# EAGLE design PT_2016_PB_MAIN_Rev1 (EAGLE 7.3.0)
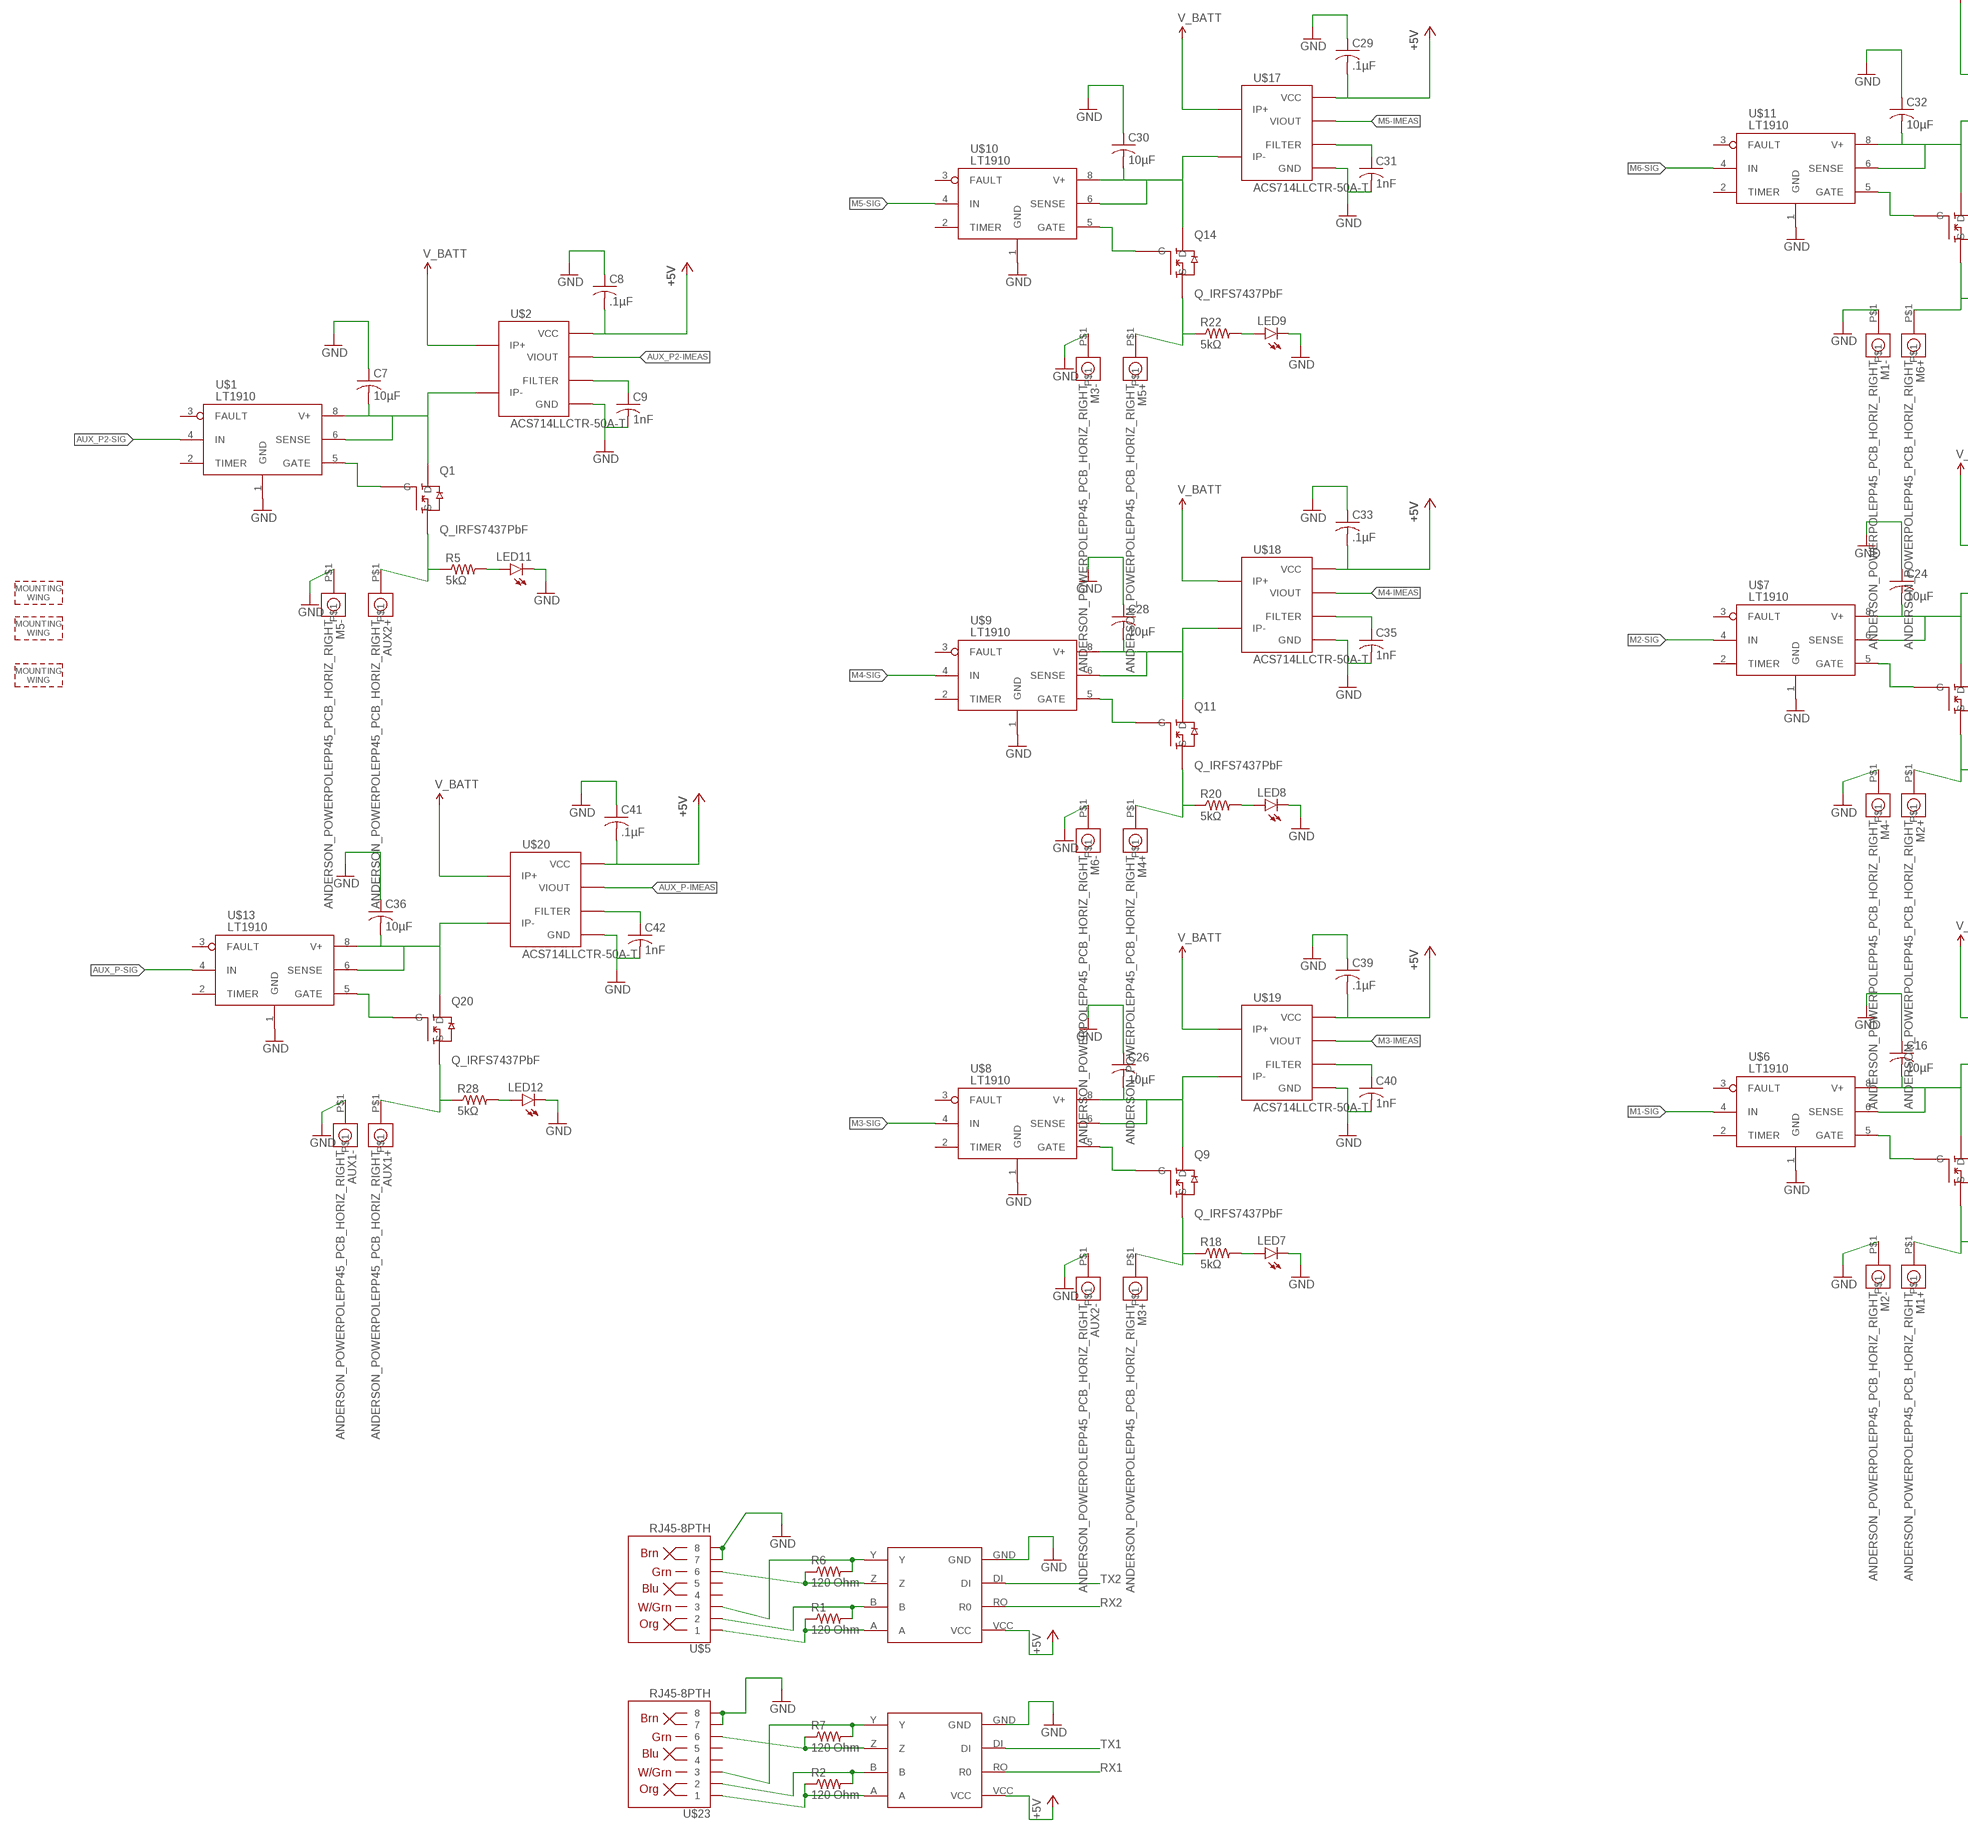
[diagram p0: schematic, sheet 1, part 1 of 3]
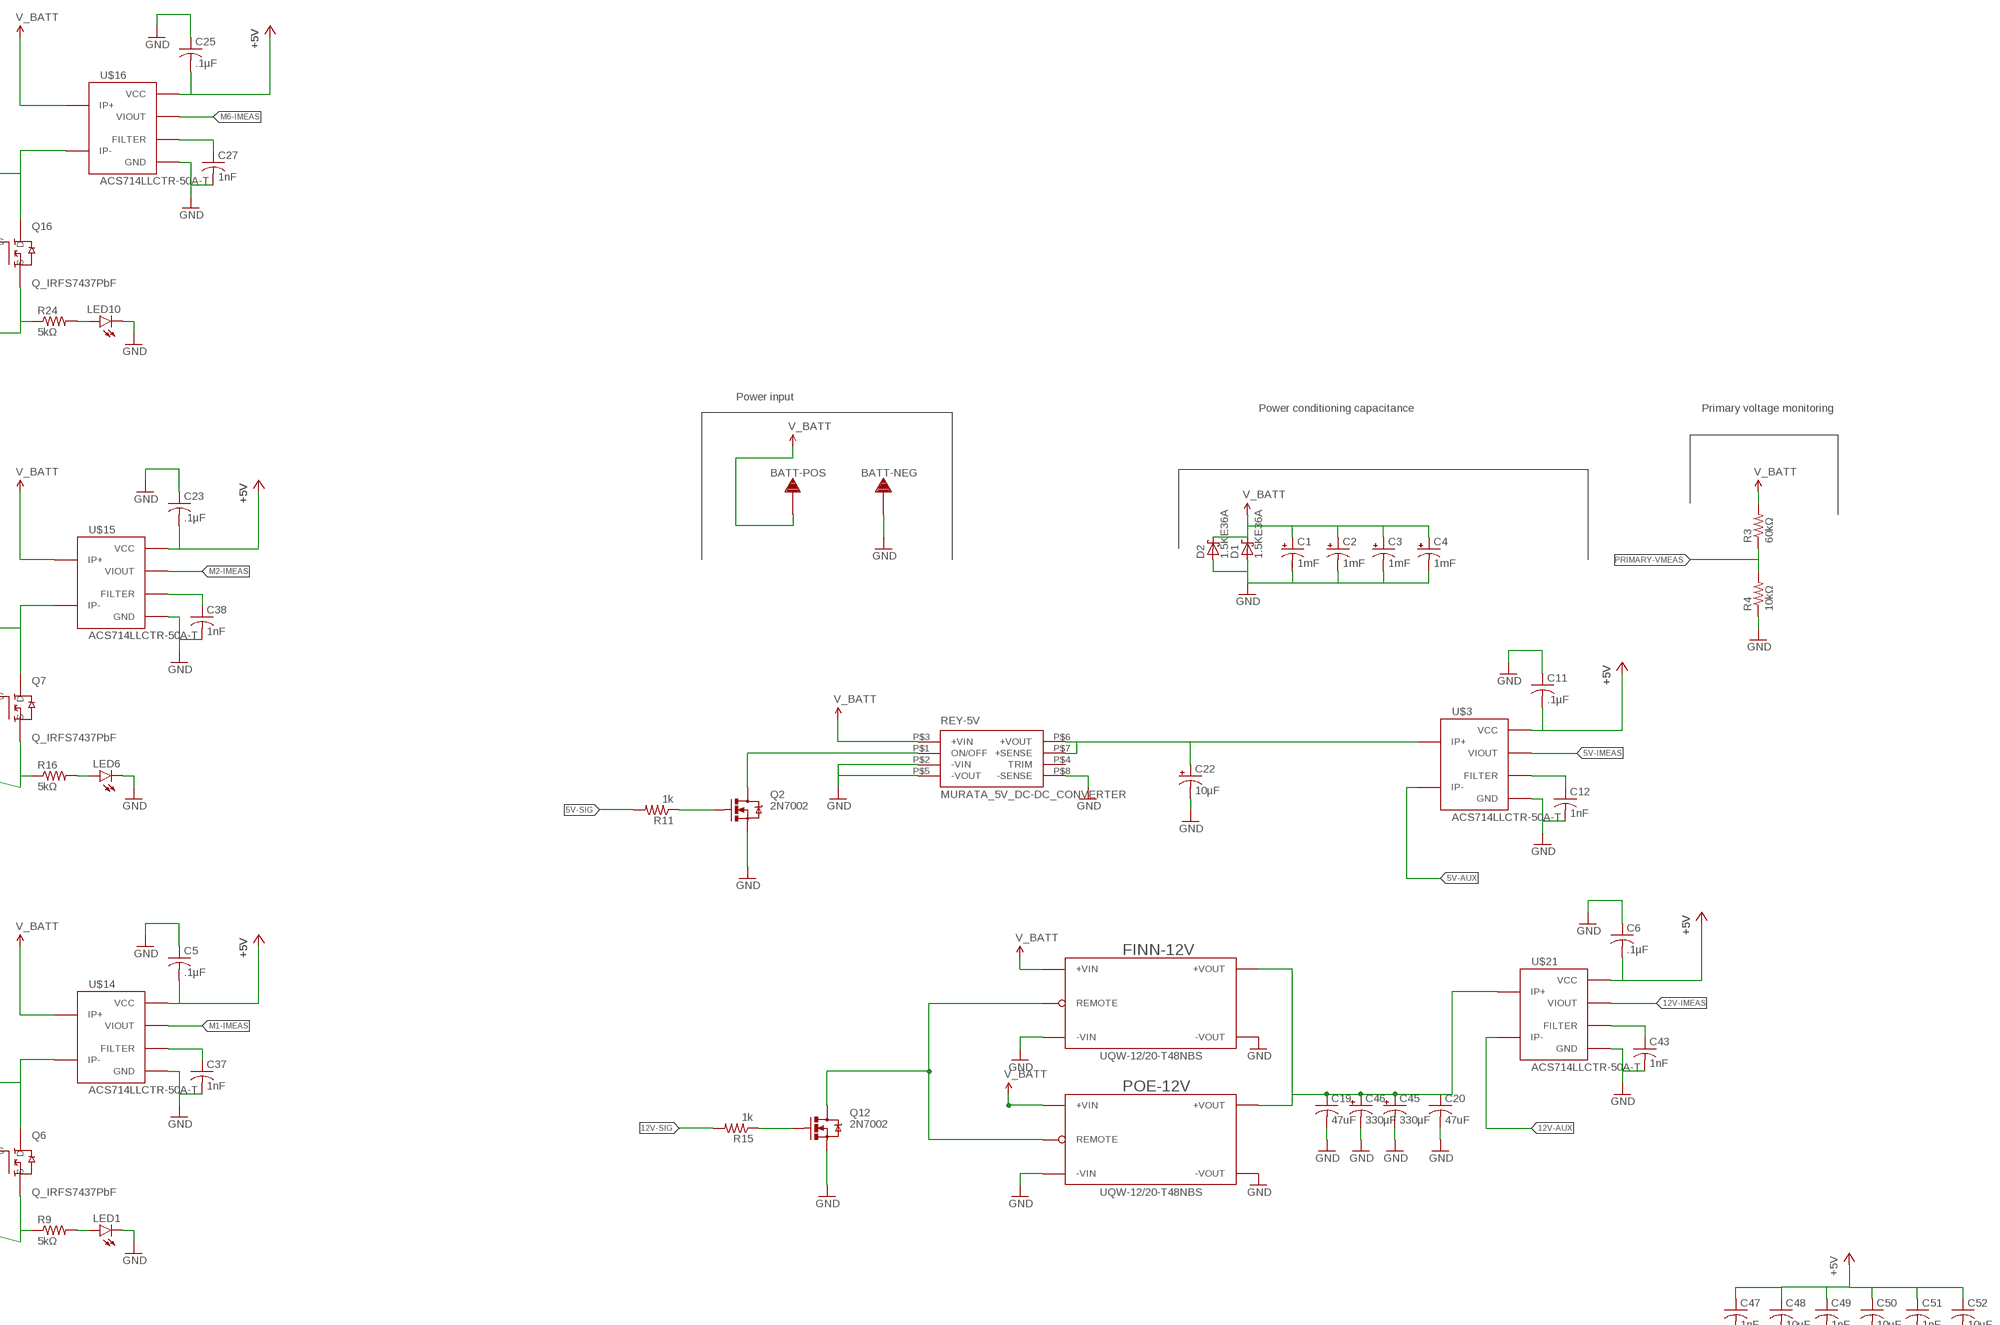
[diagram p1: schematic, sheet 1, part 2 of 3]
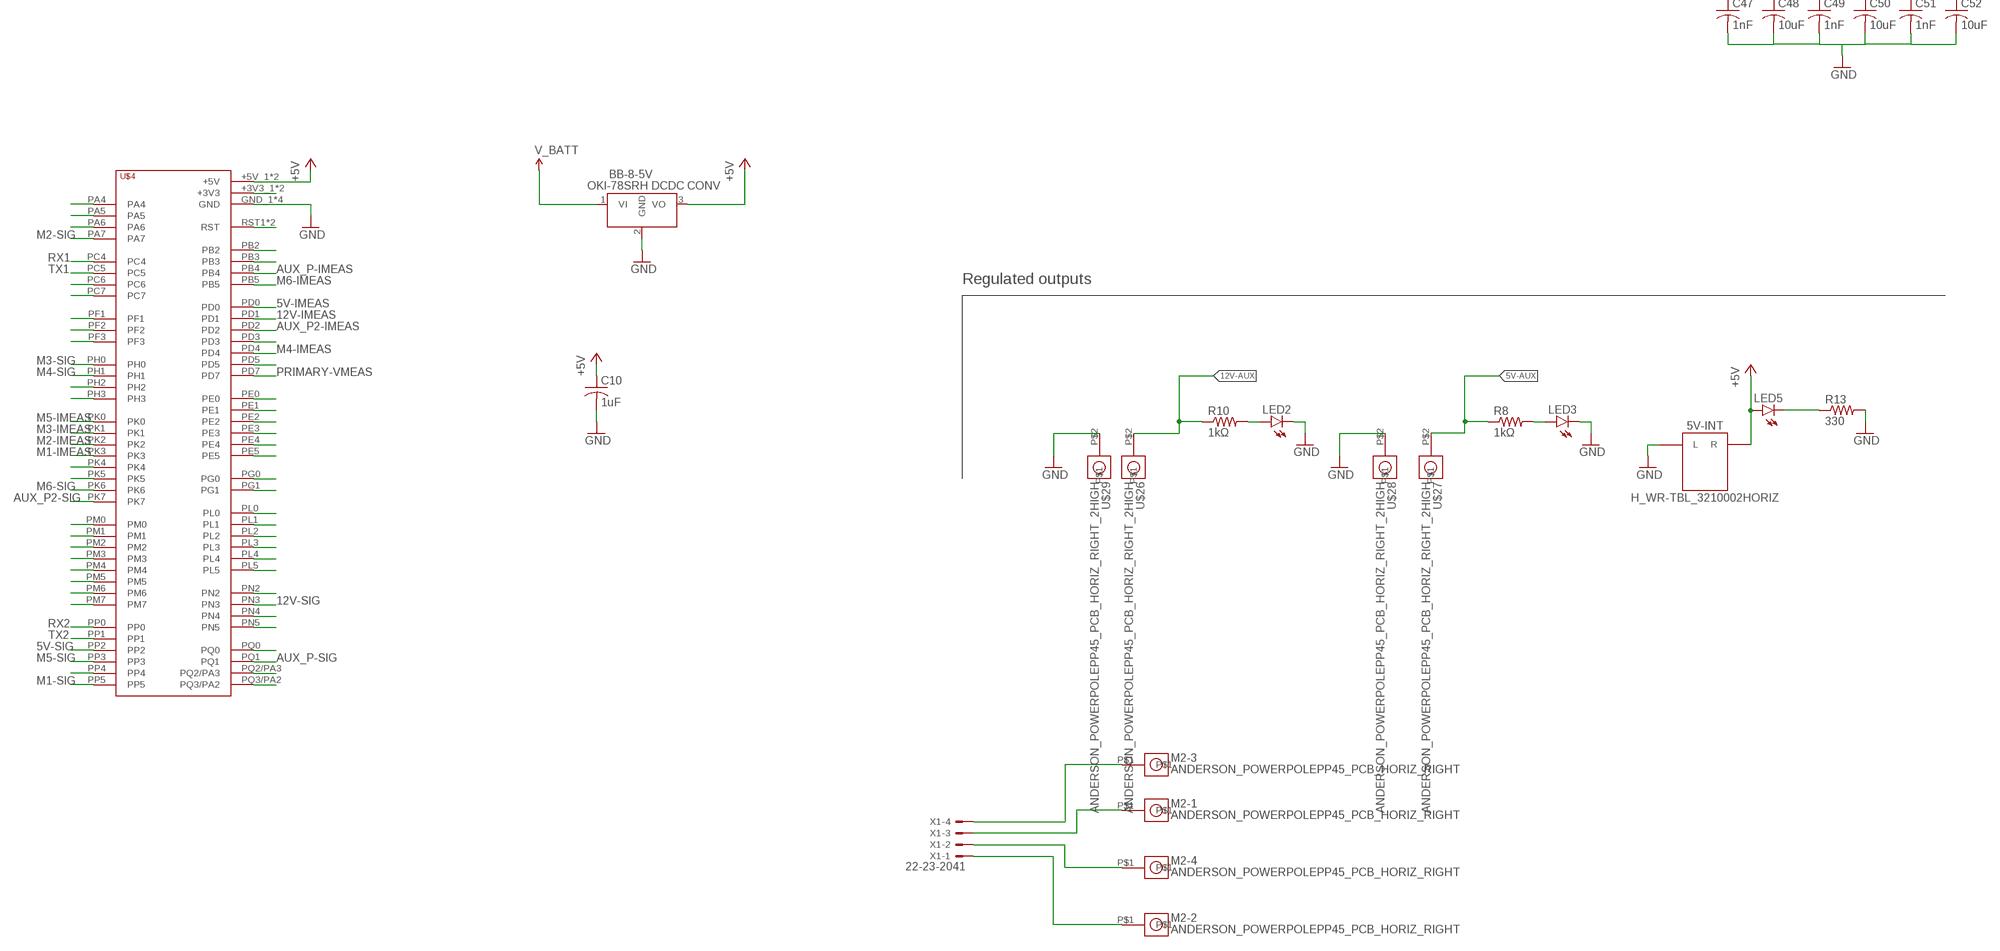
[diagram p2: schematic, sheet 1, part 3 of 3]

## Parts
5V-INT  H_WR-TBL_3210002HORIZ  [691322110002]
AUX1+  ANDERSON_POWERPOLEPP45_PCB_HORIZ_RIGHT  [APP45_PCB_HORIZ_RIGHT]
AUX1-  ANDERSON_POWERPOLEPP45_PCB_HORIZ_RIGHT  [APP45_PCB_HORIZ_RIGHT]
AUX2+  ANDERSON_POWERPOLEPP45_PCB_HORIZ_RIGHT  [APP45_PCB_HORIZ_RIGHT]
AUX2-  ANDERSON_POWERPOLEPP45_PCB_HORIZ_RIGHT  [APP45_PCB_HORIZ_RIGHT]
BATT-NEG  TERMINAL_HOLE  [LARGE_TERMINAL_HOLE]
BATT-POS  TERMINAL_HOLE  [LARGE_TERMINAL_HOLE]
BB-8-5V  Q_OKI-78SR  [OKI-78SRH]
C1  1mF  C_POL12.5MM_NORMAL  [C_12.5MM]
C2  1mF  C_POL12.5MM_NORMAL  [C_12.5MM]
C3  1mF  C_POL12.5MM_NORMAL  [C_12.5MM]
C4  1mF  C_POL12.5MM_NORMAL  [C_12.5MM]
C5  .1µF  C-USC1206  [C1206]
C6  .1µF  C-USC1206  [C1206]
C7  10µF  C-USC1206  [C1206]
C8  .1µF  C-USC1206  [C1206]
C9  1nF  C-USC1206  [C1206]
C10  1uF  C-USC1206  [C1206]
C11  .1µF  C-USC1206  [C1206]
C12  1nF  C-USC1206  [C1206]
C16  10µF  C-USC1206  [C1206]
C19  47uF  C-USC1206  [C1206]
C20  47uF  C-USC1206  [C1206]
C22  10µF  CPOL-USE5-8.5  [E5-8,5]
C23  .1µF  C-USC1206  [C1206]
C24  10µF  C-USC1206  [C1206]
C25  .1µF  C-USC1206  [C1206]
C26  10µF  C-USC1206  [C1206]
C27  1nF  C-USC1206  [C1206]
C28  10µF  C-USC1206  [C1206]
C29  .1µF  C-USC1206  [C1206]
C30  10µF  C-USC1206  [C1206]
C31  1nF  C-USC1206  [C1206]
C32  10µF  C-USC1206  [C1206]
C33  .1µF  C-USC1206  [C1206]
C35  1nF  C-USC1206  [C1206]
C36  10µF  C-USC1206  [C1206]
C37  1nF  C-USC1206  [C1206]
C38  1nF  C-USC1206  [C1206]
C39  .1µF  C-USC1206  [C1206]
C40  1nF  C-USC1206  [C1206]
C41  .1µF  C-USC1206  [C1206]
C42  1nF  C-USC1206  [C1206]
C43  1nF  C-USC1206  [C1206]
C45  330µF  CPOL-USE5-8.5  [E5-8,5]
C46  330µF  CPOL-USE5-8.5  [E5-8,5]
C47  1nF  C-USC1206  [C1206]
C48  10uF  C-USC1206  [C1206]
C49  1nF  C-USC1206  [C1206]
C50  10uF  C-USC1206  [C1206]
C51  1nF  C-USC1206  [C1206]
C52  10uF  C-USC1206  [C1206]
D1  1.5KE36A  15KEXX  [CB429-17]
D2  1.5KE36A  15KEXX  [CB429-17]
FINN-12V  UQW-12/20-T48NBS  [U-T48-QB-NO_TRIM]
LED1  LED1206  [LED-1206]
LED2  LED1206  [LED-1206]
LED3  LED1206  [LED-1206]
LED5  LED1206  [LED-1206]
LED6  LED1206  [LED-1206]
LED7  LED1206  [LED-1206]
LED8  LED1206  [LED-1206]
LED9  LED1206  [LED-1206]
LED10  LED1206  [LED-1206]
LED11  LED1206  [LED-1206]
LED12  LED1206  [LED-1206]
M1+  ANDERSON_POWERPOLEPP45_PCB_HORIZ_RIGHT  [APP45_PCB_HORIZ_RIGHT]
M1-  ANDERSON_POWERPOLEPP45_PCB_HORIZ_RIGHT  [APP45_PCB_HORIZ_RIGHT]
M2+  ANDERSON_POWERPOLEPP45_PCB_HORIZ_RIGHT  [APP45_PCB_HORIZ_RIGHT]
M2-  ANDERSON_POWERPOLEPP45_PCB_HORIZ_RIGHT  [APP45_PCB_HORIZ_RIGHT]
M2-1  ANDERSON_POWERPOLEPP45_PCB_HORIZ_RIGHT  [APP45_PCB_HORIZ_RIGHT]
M2-2  ANDERSON_POWERPOLEPP45_PCB_HORIZ_RIGHT  [APP45_PCB_HORIZ_RIGHT]
M2-3  ANDERSON_POWERPOLEPP45_PCB_HORIZ_RIGHT  [APP45_PCB_HORIZ_RIGHT]
M2-4  ANDERSON_POWERPOLEPP45_PCB_HORIZ_RIGHT  [APP45_PCB_HORIZ_RIGHT]
M3+  ANDERSON_POWERPOLEPP45_PCB_HORIZ_RIGHT  [APP45_PCB_HORIZ_RIGHT]
M3-  ANDERSON_POWERPOLEPP45_PCB_HORIZ_RIGHT  [APP45_PCB_HORIZ_RIGHT]
M4+  ANDERSON_POWERPOLEPP45_PCB_HORIZ_RIGHT  [APP45_PCB_HORIZ_RIGHT]
M4-  ANDERSON_POWERPOLEPP45_PCB_HORIZ_RIGHT  [APP45_PCB_HORIZ_RIGHT]
M5+  ANDERSON_POWERPOLEPP45_PCB_HORIZ_RIGHT  [APP45_PCB_HORIZ_RIGHT]
M5-  ANDERSON_POWERPOLEPP45_PCB_HORIZ_RIGHT  [APP45_PCB_HORIZ_RIGHT]
M6+  ANDERSON_POWERPOLEPP45_PCB_HORIZ_RIGHT  [APP45_PCB_HORIZ_RIGHT]
M6-  ANDERSON_POWERPOLEPP45_PCB_HORIZ_RIGHT  [APP45_PCB_HORIZ_RIGHT]
POE-12V  UQW-12/20-T48NBS  [U-T48-QB-NO_TRIM]
Q1  Q_IRFS7437PbF  Q_IRF7437SMD  [D2PACK]
Q2  2N7002  MOSFET-NCHANNEL2N7002PW  [SOT323]
Q6  Q_IRFS7437PbF  Q_IRF7437SMD  [D2PACK]
Q7  Q_IRFS7437PbF  Q_IRF7437SMD  [D2PACK]
Q9  Q_IRFS7437PbF  Q_IRF7437SMD  [D2PACK]
Q11  Q_IRFS7437PbF  Q_IRF7437SMD  [D2PACK]
Q12  2N7002  MOSFET-NCHANNEL2N7002PW  [SOT323]
Q14  Q_IRFS7437PbF  Q_IRF7437SMD  [D2PACK]
Q16  Q_IRFS7437PbF  Q_IRF7437SMD  [D2PACK]
Q20  Q_IRFS7437PbF  Q_IRF7437SMD  [D2PACK]
R1  120 Ohm  RESISTOR1206  [1206]
R2  120 Ohm  RESISTOR1206  [1206]
R3  60kΩ  R-US_R1206  [R1206]
R4  10kΩ  R-US_R1206  [R1206]
R5  5kΩ  RESISTOR1206  [1206]
R6  120 Ohm  RESISTOR1206  [1206]
R7  120 Ohm  RESISTOR1206  [1206]
R8  1kΩ  RESISTOR1206  [1206]
R9  5kΩ  RESISTOR1206  [1206]
R10  1kΩ  RESISTOR1206  [1206]
R11  1k  R-US_R1206  [R1206]
R13  330  RESISTOR1206  [1206]
R15  1k  R-US_R1206  [R1206]
R16  5kΩ  RESISTOR1206  [1206]
R18  5kΩ  RESISTOR1206  [1206]
R20  5kΩ  RESISTOR1206  [1206]
R22  5kΩ  RESISTOR1206  [1206]
R24  5kΩ  RESISTOR1206  [1206]
R28  5kΩ  RESISTOR1206  [1206]
REY-5V  MURATA_5V_DC-DC_CONVERTER  [MURATA_5V_DC-DC_CONVERTER]
U$1  LT1910  [SO8]
U$2  ACS714LLCTR-50A-T  Q_ACS714_SKETCH  [SOIC8_ACS711_SKETCH]
U$3  ACS714LLCTR-50A-T  Q_ACS714  [SOIC8_ACS711]
U$4  TIVA-C-CONNECTED  [TIVA-C-CONNECTED]
U$5  RJ45-8PTH  [RJ45-8]
U$6  LT1910  [SO8]
U$7  LT1910  [SO8]
U$8  LT1910  [SO8]
U$9  LT1910  [SO8]
U$10  LT1910  [SO8]
U$11  LT1910  [SO8]
U$12  MAX3077  [MAX3070E]
U$13  LT1910  [SO8]
U$14  ACS714LLCTR-50A-T  Q_ACS714_SKETCH  [SOIC8_ACS711_SKETCH]
U$15  ACS714LLCTR-50A-T  Q_ACS714_SKETCH  [SOIC8_ACS711_SKETCH]
U$16  ACS714LLCTR-50A-T  Q_ACS714_SKETCH  [SOIC8_ACS711_SKETCH]
U$17  ACS714LLCTR-50A-T  Q_ACS714_SKETCH  [SOIC8_ACS711_SKETCH]
U$18  ACS714LLCTR-50A-T  Q_ACS714_SKETCH  [SOIC8_ACS711_SKETCH]
U$19  ACS714LLCTR-50A-T  Q_ACS714_SKETCH  [SOIC8_ACS711_SKETCH]
U$20  ACS714LLCTR-50A-T  Q_ACS714_SKETCH  [SOIC8_ACS711_SKETCH]
U$21  ACS714LLCTR-50A-T  Q_ACS714  [SOIC8_ACS711]
U$23  RJ45-8PTH  [RJ45-8]
U$24  MAX3077  [MAX3070E]
U$25  APP_MOUTING_WINGHORIZ  [APP45_MOUNTING_WING_HORIZ]
U$26  ANDERSON_POWERPOLEPP45_PCB_HORIZ_RIGHT_2HIGH  [APP45_PCB_HORIZ_RIGHT_2HIGH]
U$27  ANDERSON_POWERPOLEPP45_PCB_HORIZ_RIGHT_2HIGH  [APP45_PCB_HORIZ_RIGHT_2HIGH]
U$28  ANDERSON_POWERPOLEPP45_PCB_HORIZ_RIGHT_2HIGH  [APP45_PCB_HORIZ_RIGHT_2HIGH]
U$29  ANDERSON_POWERPOLEPP45_PCB_HORIZ_RIGHT_2HIGH  [APP45_PCB_HORIZ_RIGHT_2HIGH]
U$41  APP_MOUTING_WINGHORIZ  [APP45_MOUNTING_WING_HORIZ]
U$42  APP_MOUTING_WINGHORIZ  [APP45_MOUNTING_WING_HORIZ]
X1  22-23-2041  [22-23-2041]

## Nets
5V-AUX: R8.1 U$3.4(IP-) U$27.P$2
5V-IMEAS: U$3.7(VIOUT) U$4.PD0
5V-SIG: R11.2 U$4.PP2
12V-AUX: R10.1 U$21.4(IP-) U$26.P$2
12V-IMEAS: U$4.PD1 U$21.7(VIOUT)
12V-SIG: R15.2 U$4.PN3
+5V: 5V-INT.R BB-8-5V.3(VO) C5.2 C6.2 C8.2 C10.1 C11.2 C23.2 C25.2 C29.2 C33.2 C39.2 C41.2 C47.1 C48.1 C49.1 C50.1 C51.1 C52.1 LED5.A U$2.8(VCC) U$3.8(VCC) U$4.+5V_1(+5V) U$4.+5V_2(+5V) U$12.VCC U$14.8(VCC) U$15.8(VCC) U$16.8(VCC) U$17.8(VCC) U$18.8(VCC) U$19.8(VCC) U$20.8(VCC) U$21.8(VCC) U$24.VCC
AUX_P2-IMEAS: U$2.7(VIOUT) U$4.PD2
AUX_P2-SIG: U$1.4(IN) U$4.PK7
AUX_P-IMEAS: U$4.PB4 U$20.7(VIOUT)
AUX_P-SIG: U$4.PQ1 U$13.4(IN)
GND: 5V-INT.L AUX1-.P$1 AUX2-.P$1 BATT-NEG.P$1 BB-8-5V.2(GND) C1.- C2.- C3.- C4.- C5.1 C6.1 C7.1 C8.1 C9.2 C10.2 C11.1 C12.2 C16.1 C19.2 C20.2 C22.- C23.1 C24.1 C25.1 C26.1 C27.2 C28.1 C29.1 C30.1 C31.2 C32.1 C33.1 C35.2 C36.1 C37.2 C38.2 C39.1 C40.2 C41.1 C42.2 C43.2 C45.- C46.- C47.2 C48.2 C49.2 C50.2 C51.2 C52.2 D1.A D2.A FINN-12V.3(-VIN) FINN-12V.4(-VOUT) LED1.C LED2.C LED3.C LED6.C LED7.C LED8.C LED9.C LED10.C LED11.C LED12.C M1-.P$1 M2-.P$1 M3-.P$1 M4-.P$1 M5-.P$1 M6-.P$1 POE-12V.3(-VIN) POE-12V.4(-VOUT) Q2.2(S) Q12.2(S) R4.1 R13.2 REY-5V.P$2(-VIN) REY-5V.P$5(-VOUT) REY-5V.P$8(-SENSE) U$1.1(GND) U$2.5(GND) U$3.5(GND) U$4.GND_1(GND) U$4.GND_2(GND) U$4.GND_3(GND) U$4.GND_4(GND) U$5.7 U$5.8 U$6.1(GND) U$7.1(GND) U$8.1(GND) U$9.1(GND) U$10.1(GND) U$11.1(GND) U$12.GND U$13.1(GND) U$14.5(GND) U$15.5(GND) U$16.5(GND) U$17.5(GND) U$18.5(GND) U$19.5(GND) U$20.5(GND) U$21.5(GND) U$23.7 U$23.8 U$24.GND U$28.P$2 U$29.P$2
M1-IMEAS: U$4.PK3 U$14.7(VIOUT)
M1-SIG: U$4.PP5 U$6.4(IN)
M2-IMEAS: U$4.PK2 U$15.7(VIOUT)
M2-SIG: U$4.PA7 U$7.4(IN)
M3-IMEAS: U$4.PK1 U$19.7(VIOUT)
M3-SIG: U$4.PH0 U$8.4(IN)
M4-IMEAS: U$4.PD4 U$18.7(VIOUT)
M4-SIG: U$4.PH1 U$9.4(IN)
M5-IMEAS: U$4.PK0 U$17.7(VIOUT)
M5-SIG: U$4.PP3 U$10.4(IN)
M6-IMEAS: U$4.PB5 U$16.7(VIOUT)
M6-SIG: U$4.PK6 U$11.4(IN)
N$1: C37.1 U$14.6(FILTER)
N$2: C38.1 U$15.6(FILTER)
N$3: M2-3.P$1 X1.4
N$4: FINN-12V.2(REMOTE) POE-12V.2(REMOTE) Q12.3(D)
N$5: M2-1.P$1 X1.3
N$6: LED5.C R13.1
N$7: C22.+ REY-5V.P$6(+VOUT) REY-5V.P$7(+SENSE) U$3.1(IP+)
N$8: M2-4.P$1 X1.2
N$9: C7.2 Q1.TAB(D) U$1.6(SENSE) U$1.8(V+) U$2.4(IP-)
N$10: AUX2+.P$1 Q1.2(S) R5.1
N$11: M2-2.P$1 X1.1
N$12: C43.1 U$21.6(FILTER)
N$14: Q1.1(G) U$1.5(GATE)
N$15: LED11.A R5.2
N$16: C9.1 U$2.6(FILTER)
N$17: C27.1 U$16.6(FILTER)
N$21: U$4.PH3
N$22: C31.1 U$17.6(FILTER)
N$23: C35.1 U$18.6(FILTER)
N$24: C40.1 U$19.6(FILTER)
N$25: C42.1 U$20.6(FILTER)
N$28: C24.2 Q7.TAB(D) U$7.6(SENSE) U$7.8(V+) U$15.4(IP-)
N$29: M2+.P$1 Q7.2(S) R16.1
N$30: Q7.1(G) U$7.5(GATE)
N$31: LED6.A R16.2
N$33: C19.1 C20.1 C45.+ C46.+ FINN-12V.8(+VOUT) POE-12V.8(+VOUT) U$21.1(IP+)
N$34: LED3.A R8.2
N$35: U$4.PA4
N$36: U$4.PA5
N$37: U$4.PA6
N$38: C12.1 U$3.6(FILTER)
N$39: LED1.A R9.2
N$40: C16.2 Q6.TAB(D) U$6.6(SENSE) U$6.8(V+) U$14.4(IP-)
N$41: M1+.P$1 Q6.2(S) R9.1
N$42: Q6.1(G) U$6.5(GATE)
N$43: Q2.3(D) REY-5V.P$1(ON/OFF)
N$44: C26.2 Q9.TAB(D) U$8.6(SENSE) U$8.8(V+) U$19.4(IP-)
N$45: M3+.P$1 Q9.2(S) R18.1
N$46: LED2.A R10.2
N$47: Q9.1(G) U$8.5(GATE)
N$48: Q2.1(G) R11.1
N$49: LED7.A R18.2
N$50: U$4.PC6
N$51: U$4.PC7
N$52: U$4.PF1
N$53: U$4.PF2
N$54: C28.2 Q11.TAB(D) U$9.6(SENSE) U$9.8(V+) U$18.4(IP-)
N$55: M4+.P$1 Q11.2(S) R20.1
N$56: Q11.1(G) U$9.5(GATE)
N$57: LED8.A R20.2
N$58: U$4.PF3
N$60: C30.2 Q14.TAB(D) U$10.6(SENSE) U$10.8(V+) U$17.4(IP-)
N$61: M5+.P$1 Q14.2(S) R22.1
N$62: Q14.1(G) U$10.5(GATE)
N$63: LED9.A R22.2
N$66: C32.2 Q16.TAB(D) U$11.6(SENSE) U$11.8(V+) U$16.4(IP-)
N$67: M6+.P$1 Q16.2(S) R24.1
N$68: Q16.1(G) U$11.5(GATE)
N$69: LED10.A R24.2
N$70: U$4.PH2
N$75: U$4.PK4
N$78: C36.2 Q20.TAB(D) U$13.6(SENSE) U$13.8(V+) U$20.4(IP-)
N$79: AUX1+.P$1 Q20.2(S) R28.1
N$80: Q20.1(G) U$13.5(GATE)
N$81: LED12.A R28.2
N$82: U$4.PK5
N$83: U$4.PM0
N$84: U$4.PM1
N$85: U$4.PM2
N$86: U$4.PM3
N$87: U$4.PM4
N$88: U$4.PM5
N$89: U$4.PM6
N$90: U$4.PM7
N$93: U$4.PP4
N$96: U$4.PN2
N$98: U$4.+3V3_1(+3V3) U$4.+3V3_2(+3V3)
N$99: U$4.PL5
N$100: U$4.RST1(RST) U$4.RST_2(RST)
N$101: U$4.PB2
N$102: U$4.PB3
N$108: U$4.PD3
N$110: U$4.PD5
N$112: U$4.PE0
N$113: U$4.PE1
N$114: Q12.1(G) R15.1
N$115: U$4.PE2
N$116: U$4.PE3
N$117: U$4.PE4
N$118: U$4.PE5
N$119: U$4.PG0
N$120: U$4.PG1
N$121: U$4.PL0
N$122: U$4.PL1
N$123: U$4.PL2
N$124: U$4.PL3
N$125: U$4.PL4
N$129: U$4.PN4
N$130: U$4.PN5
N$131: U$4.PQ0
N$133: U$4.PQ2/PA3
N$134: U$4.PQ3/PA2
PRIMARY-VMEAS: R3.1 R4.2 U$4.PD7
REC+: R1.1 U$5.1 U$12.A
REC+1: R2.1 U$23.1 U$24.A
REC-: R1.2 U$5.2 U$12.B
REC-1: R2.2 U$23.2 U$24.B
RX1: U$4.PC4 U$24.RO(R0)
RX2: U$4.PP0 U$12.RO(R0)
TRANS+: R6.2 U$5.3 U$12.Y
TRANS+1: R7.2 U$23.3 U$24.Y
TRANS-: R6.1 U$5.6 U$12.Z
TRANS-1: R7.1 U$23.6 U$24.Z
TX1: U$4.PC5 U$24.DI
TX2: U$4.PP1 U$12.DI
V_BATT: BATT-POS.P$1 BB-8-5V.1(VI) C1.+ C2.+ C3.+ C4.+ D1.C D2.C FINN-12V.1(+VIN) POE-12V.1(+VIN) R3.2 REY-5V.P$3(+VIN) U$2.1(IP+) U$14.1(IP+) U$15.1(IP+) U$16.1(IP+) U$17.1(IP+) U$18.1(IP+) U$19.1(IP+) U$20.1(IP+)
Unconnected: REY-5V.P$4(TRIM) U$1.2(TIMER) U$1.3(FAULT) U$5.4 U$5.5 U$6.2(TIMER) U$6.3(FAULT) U$7.2(TIMER) U$7.3(FAULT) U$8.2(TIMER) U$8.3(FAULT) U$9.2(TIMER) U$9.3(FAULT) U$10.2(TIMER) U$10.3(FAULT) U$11.2(TIMER) U$11.3(FAULT) U$13.2(TIMER) U$13.3(FAULT) U$23.4 U$23.5

## Notes on the sheet
- Power input
- Power conditioning capacitance | Primary voltage monitoring
- Regulated outputs

## Library data of the parts
5V-INT = MRDT-2015-PowerBoard:H_WR-TBL_32*1*0002: Wurth Electronic's 2-pin 10A pluggable screw terminal headers. Vertical and Horizantal Part Numbers: 691322110002 (Horizantal) 691321100002 (Vertical); DIGIKEY_PN: 732-2769-ND
AUX1+ AUX1- AUX2+ AUX2- M1+ M1- M2+ M2- M2-1-M2-4 M3+ M3- M4+ M4- M5+ M5- M6+ M6- U$26-U$29 = MRDT-Connectors:ANDERSON_POWERPOLE: http://www.powerwerx.com/anderson-powerpoles/
BATT-NEG BATT-POS = MRDT-2015-PowerBoard:TERMINAL_HOLE
BB-8-5V = MRDT-2015-PowerBoard:Q_OKI-78SR: 4.95W DC/DC Converter Manufacturer: Murata Part Number: OKI-78SR-5/1.5-W36H-C OKI-78SR-3.3/1.5-W36H-C
C1-C4 = MRDT-2014-All:C_POL: Alum Elect. Cap with 10mm diameter, 5mm lead spacing and 0.7mm lead diameter
C5-C12 C16 C19 C20 C23-C33 C35-C43 C47-C52 = resistor:C-US: CAPACITOR, American symbol
C22 C45 C46 = resistor:CPOL-US: POLARIZED CAPACITOR, American symbol
D1 D2 = diode:15KEXX: DIODE
FINN-12V POE-12V = MRDT-2015-PowerBoard:UQW-12/20-T48NBS
LED1-LED3 LED5-LED12 = SparkFun-LED:LED: LEDs Standard schematic elements and footprints for 5mm, 3mm, 1206, and 0603 sized LEDs. 5mm - Spark Fun Electronics SKU : COM-00529 (and others)
Q1 Q6 Q7 Q9 Q11 Q14 Q16 Q20 = MRDT-2015-PowerBoard:Q_IRF*7437: 40V 195A N-CH MOSFET switch with heatsink
Q2 Q12 = SparkFun-DiscreteSemi:MOSFET-NCHANNEL: Common NMOSFET Parts MFG P/N Store ID Prod ID FDD8780 TRANS-09984 SI7820DN TRANS-11055 FDS6630A IC-08089 2N7002PW TRANS-11151 FQP30N06L COM-10213 TRANS-10060 BSS123LT1G TRANS-08345 BSS138 TRANS-00830 BS170 2N7000; PROD_ID: TRANS-11151
R1 R2 R5-R10 R13 R16 R18 R20 R22 R24 R28 = SparkFun-Passives:RESISTOR: Resistor Basic schematic elements and footprints for 0603, 1206, and PTH resistors.
R3 R4 R11 R15 = resistor:R-US_: RESISTOR, American symbol
REY-5V = MRDT-2015-PowerBoard:MURATA_5V_DC-DC_CONVERTER
U$1 U$6-U$11 U$13 = Jake:LT1910
U$2 U$3 U$14-U$21 = MRDT-2015-PowerBoard:Q_ACS714: Sketch variant has increased clearance for traces.
U$4 = MRDT-2015-General:TIVA-C-CONNECTED: TIVA C CONNECTED LAUNCHPAD
U$5 U$23 = SparkFun-Connectors:RJ45-8: RJ45 Jack Simple RJ45, 8-pin connection - connector for common Cat5, Cat5e, and Cat6 Ethernet cables. Footprint not yet proven in production. Connector sku is PRT-00643; Breakout PCB sku is BOB-00716.; PROD_ID: CONN-08506; VALUE: RJ45
U$12 U$24 = MAX3077:MAX3077
U$25 U$41 U$42 = MRDT-Connectors:APP_MOUTING_WING
X1 = con-molex:22-23-2041: .100" (2.54mm) Center Header - 4 Pin; MF: MOLEX; MPN: 22-23-2041; OC_FARNELL: 1462920; OC_NEWARK: 38C0355

## Board
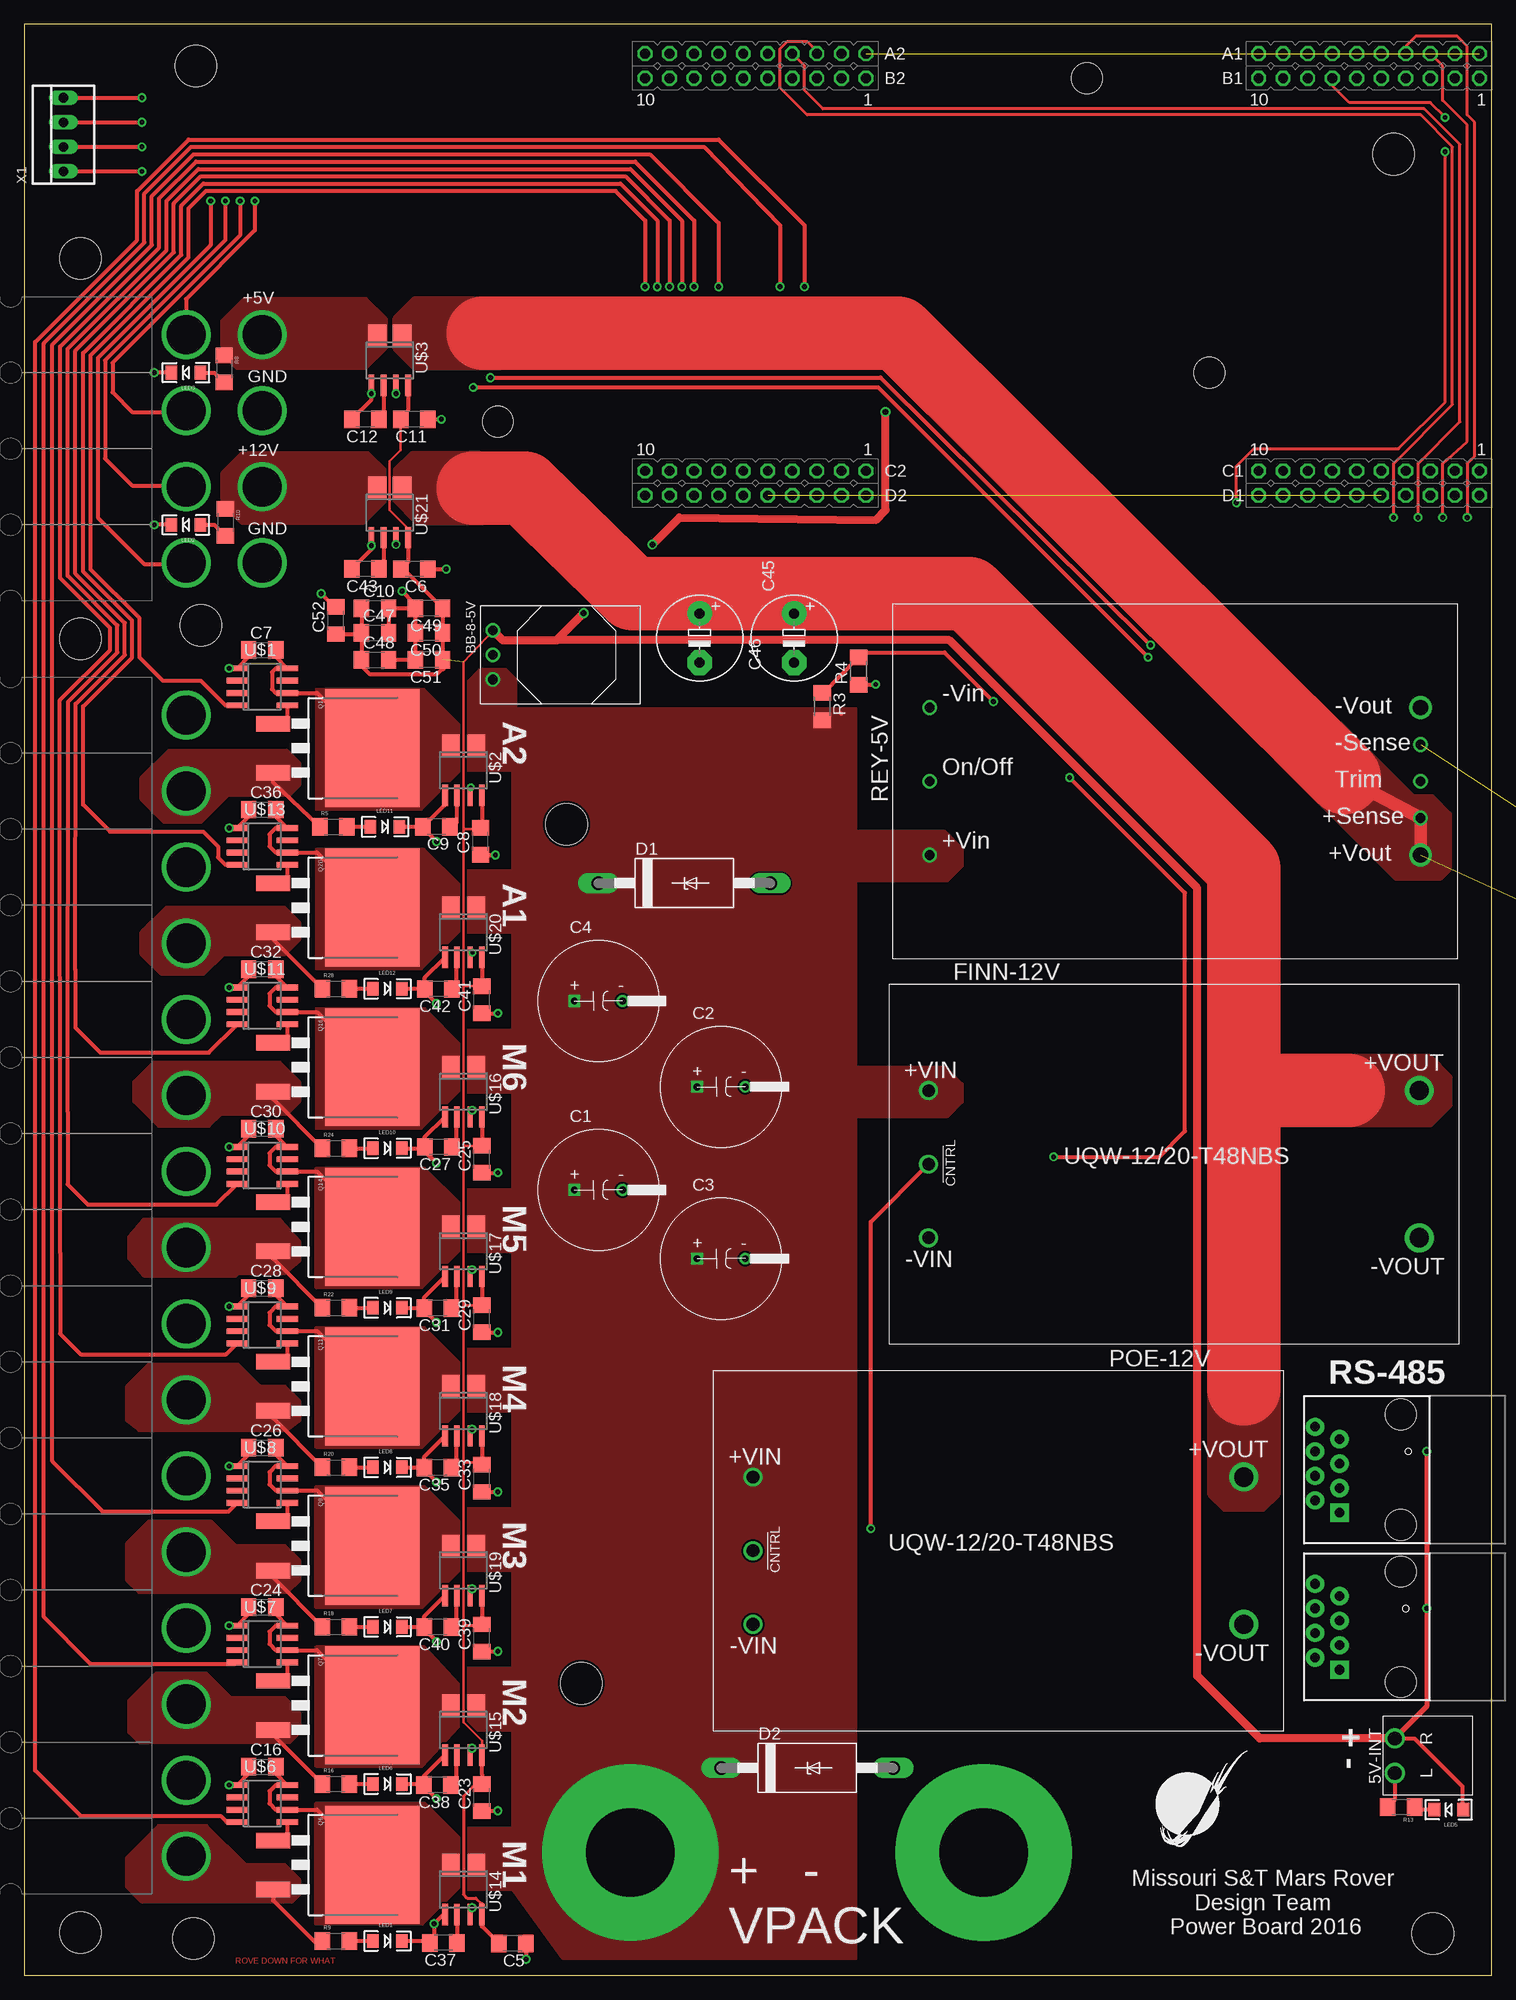
[diagram p3: board, top side]
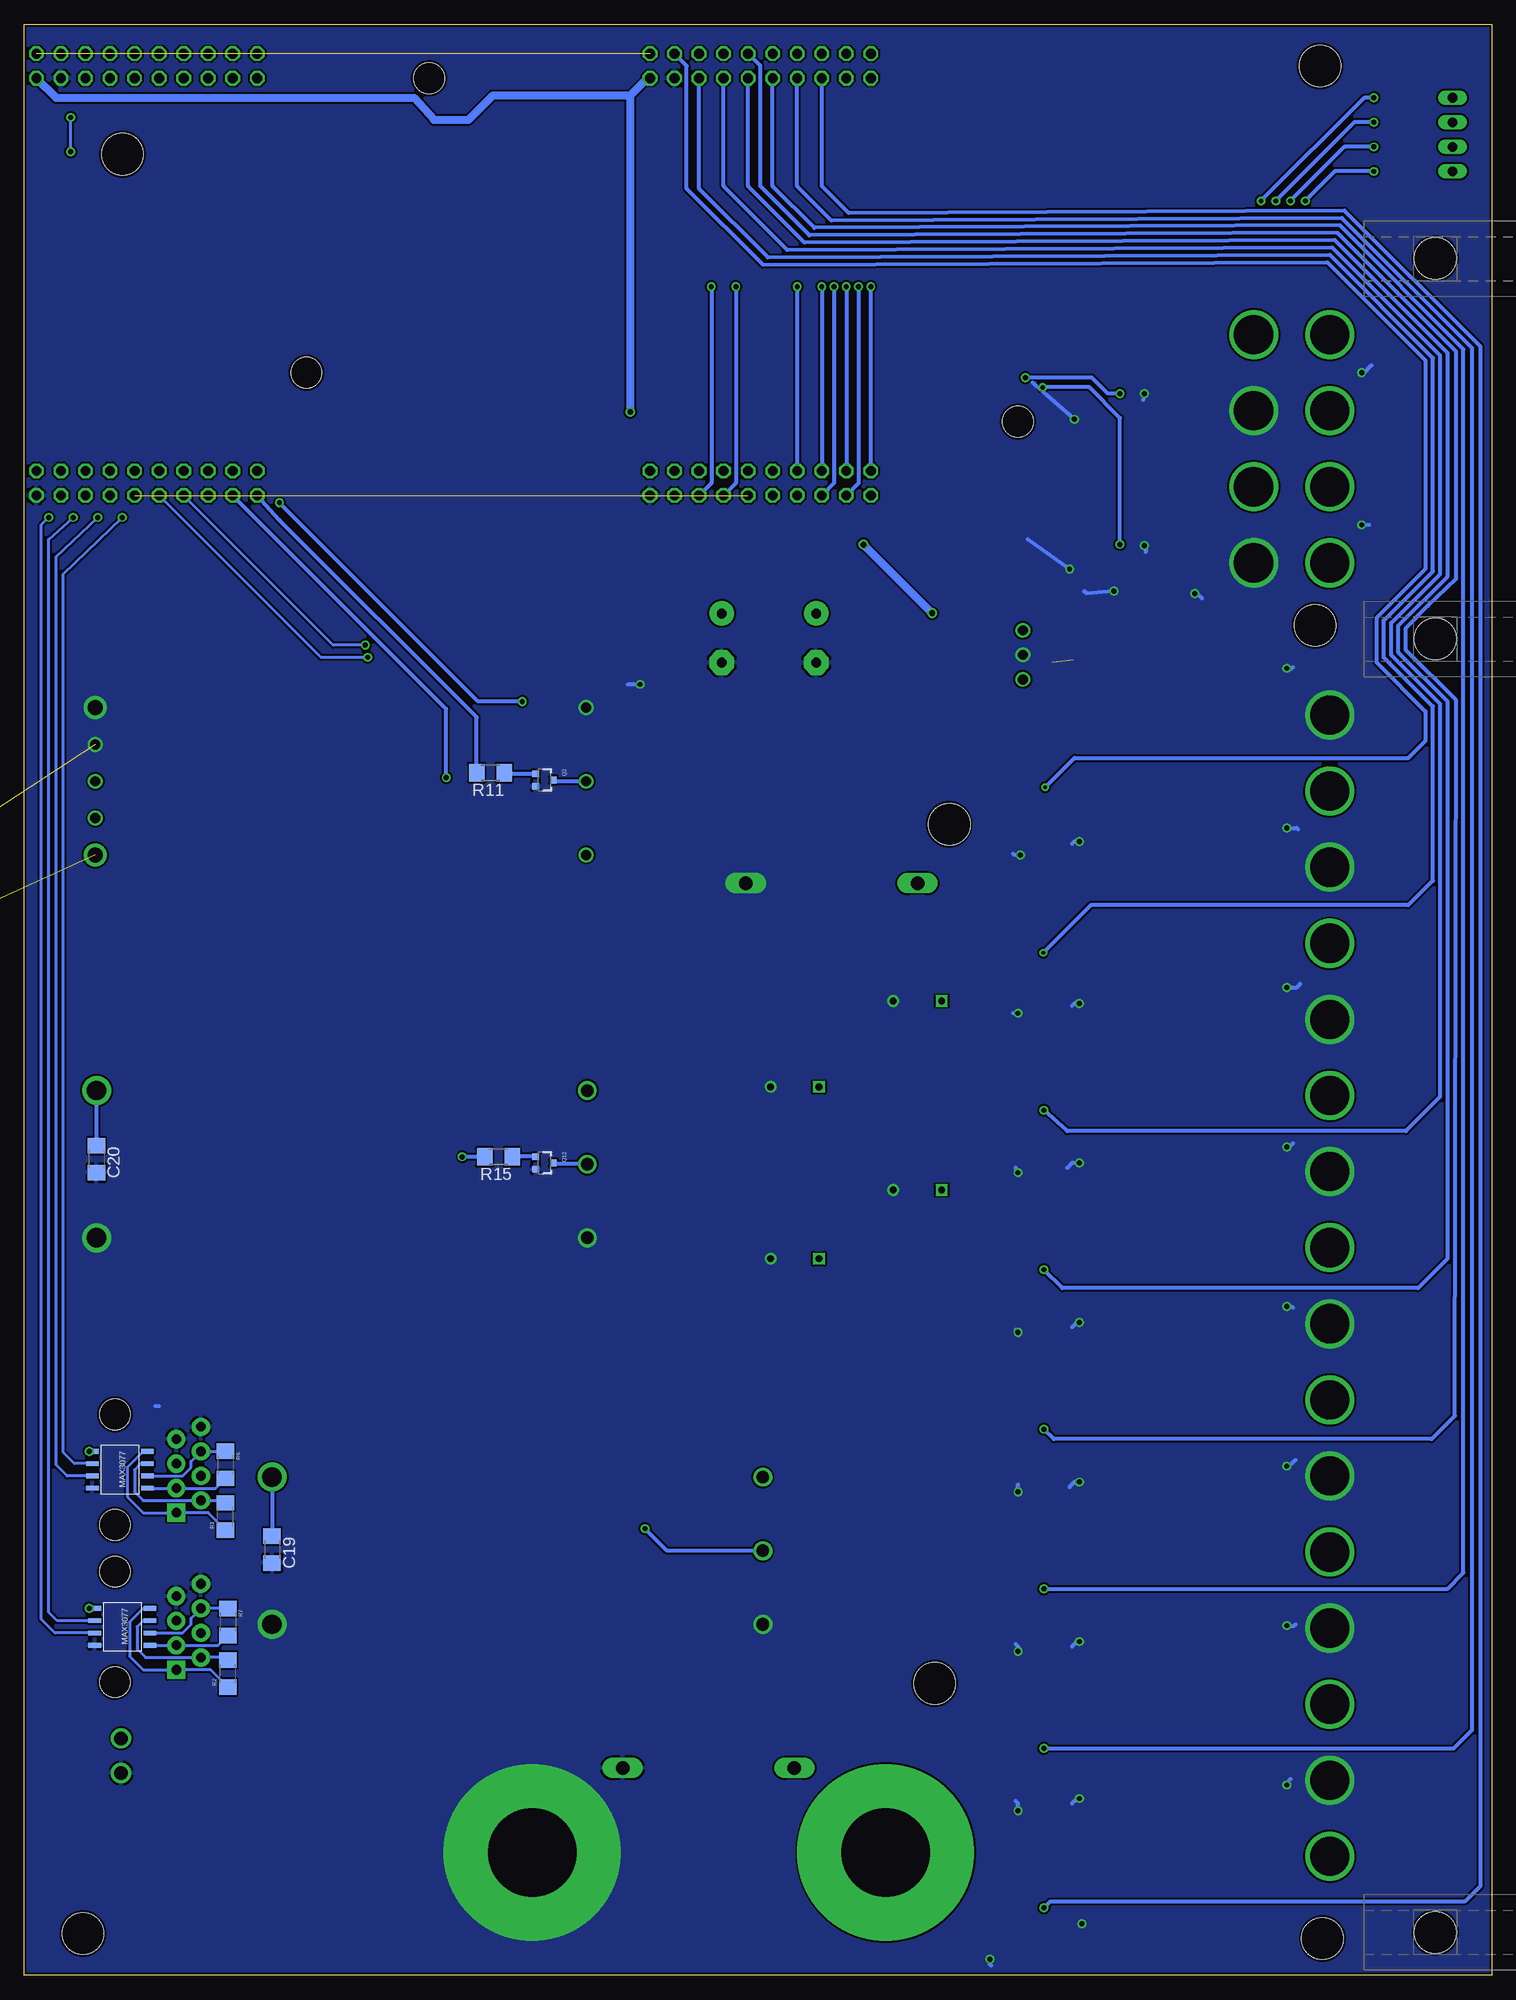
[diagram p4: board, bottom side, seen from below]

Size 151.89 x 201.93 mm. Coordinates in mm from the lower left corner, seen from the top.
Outline: 0,0 151.89,0 151.89,201.93 0,201.93 0,0
Copper layers (1*16): Top 0.035559375mm / dielectric 1.501140625mm / Bottom 0.035559375mm
Design rules "typical_4pcb *": minimum track width 6mil, minimum drill 10mil, track to track 8mil, track to pad 8mil, pad to pad 8mil, via to via 8mil, smd to smd 8mil, copper to edge 10mil, drill to drill 8mil, minimum pad ring 10mil, minimum via ring 8mil, stop-mask expansion 4mil, vias tented up to drill 0mil, thermal gap 10mil
Holes 4.32 mm at 145.8,4.32 18.29,139.7 17.78,197.61 17.53,3.81 56.13,119.13 141.73,188.47 57.66,30.23
Holes 3.2 mm at 109.98,196.34 122.68,165.86 49.02,160.78

### Footprints (pad centres in the part's own frame; a part is rotated, then mirrored left to right if it is on the bottom)
691322110002 = drill 1.4: L -1.79,0; R 1.79,0
APP45_PCB_HORIZ_RIGHT = drill 4.064: P$1 28.194,3.937
LARGE_TERMINAL_HOLE = drill 9.144 pad 18.288: P$1 0,0
OKI-78SRH = drill 1.016: 1 2.54,0; 2 0,0; 3 -2.54,0
C_12.5MM = drill 0.7 square: + -2.5,0 | drill 0.7: - 2.5,0
C1206 = smd 1.6 x 1.8: 1 -1.4,0; 2 1.4,0
E5-8,5 = drill 1.016 pad 2.54: + -2.54,0 | drill 1.016 pad 2.54 octagon: - 2.54,0
CB429-17 = drill 1.397 long: A 8.89,0; C -8.89,0
U-T48-QB-NO_TRIM = drill 1.3: 1 -25.4,7.62; 2 -25.4,0; 3 -25.4,-7.62 | drill 2: 4 25.4,-7.62; 8 25.4,7.62
LED-1206 = smd 1.2 x 1.4: A -1.5,0; C 1.5,0
D2PACK = smd 1.6 x 3.5: 1 -2.54,-8.275; 2 2.54,-8.275 | smd 12.2 x 9.75: TAB 0,2
SOT323 = smd 0.7 x 0.7: 1 -0.65,-0.925; 2 0.65,-0.925; 3 0,0.925
1206 = smd 1.6 x 1.8: 1 -1.4,0; 2 1.4,0
R1206 = smd 1.6 x 1.803: 1 -1.422,0; 2 1.422,0
MURATA_5V_DC-DC_CONVERTER = drill 1.016: P$1 -24.13,-0.635; P$2 -24.13,6.985; P$3 -24.13,-8.255; P$4 26.67,-0.635; P$7 26.67,-4.445; P$8 26.67,3.175 | drill 1.575: P$5 26.67,6.985; P$6 26.67,-8.255
SO8 = smd 0.6 x 2.2: 1 -1.905,-2.6; 2 -0.635,-2.6; 3 0.635,-2.6; 4 1.905,-2.6; 5 1.905,2.6; 6 0.635,2.6; 7 -0.635,2.6; 8 -1.905,2.6
SOIC8_ACS711_SKETCH = smd 1.8 x 2.2: 1 -1.321,-2.6; 4 1.321,-2.6 | smd 0.6 x 2.2: 5 1.905,2.6; 8 -1.905,2.6 | smd 0.55 x 2.2: 6 0.686,2.6; 7 -0.686,2.6
SOIC8_ACS711 = smd 1.92 x 2.2: 1 -1.27,-2.6; 4 1.27,-2.6 | smd 0.6 x 2.2: 5 1.905,2.6; 6 0.635,2.6; 7 -0.635,2.6; 8 -1.905,2.6
TIVA-C-CONNECTED = drill 1.016 octagon: +3V3_1 59.69,54.61; +3V3_2 123.19,54.61; +5V_1 59.69,52.07; +5V_2 123.19,52.07; GND_1 57.15,52.07; GND_2 59.69,8.89; GND_3 120.65,52.07; GND_4 123.19,8.89; PA4 39.37,52.07; PA5 36.83,52.07; PA6 105.41,52.07; PA7 52.07,8.89; PB2 102.87,54.61; PB3 100.33,54.61; PB4 54.61,52.07; PB5 52.07,52.07; PC4 118.11,54.61; PC5 115.57,54.61; PC6 113.03,54.61; PC7 105.41,54.61; PD0 107.95,8.89; PD1 110.49,8.89; PD2 57.15,54.61; PD3 107.95,54.61; PD4 49.53,54.61; PD5 46.99,54.61; PD7 107.95,52.07; PE0 118.11,52.07; PE1 115.57,52.07; PE2 113.03,52.07; PE3 110.49,52.07; PE4 120.65,54.61; PE5 110.49,54.61; PF1 123.19,11.43; PF2 120.65,11.43; PF3 118.11,11.43; PG0 115.57,11.43; PG1 59.69,11.43; PH0 44.45,11.43; PH1 41.91,11.43; PH2 118.11,8.89; PH3 115.57,8.89; PK0 49.53,52.07; PK1 46.99,52.07; PK2 44.45,52.07; PK3 41.91,52.07; PK4 57.15,11.43; PK5 54.61,11.43; PK6 39.37,11.43; PK7 36.83,11.43; PL0 107.95,11.43; PL1 105.41,11.43; PL2 102.87,11.43; PL3 100.33,11.43; PL4 113.03,11.43; PL5 110.49,11.43; PM0 52.07,11.43; PM1 49.53,11.43; PM2 46.99,11.43; PM3 120.65,8.89; PM4 102.87,52.07; PM5 100.33,52.07; PM6 36.83,8.89; PM7 57.15,8.89; PN2 105.41,8.89; PN3 102.87,8.89; PN4 36.83,54.61; PN5 39.37,54.61; PP0 54.61,54.61; PP1 52.07,54.61; PP2 100.33,8.89; PP3 41.91,8.89; PP4 41.91,54.61; PP5 54.61,8.89; PQ0 44.45,54.61; PQ1 39.37,8.89; PQ2/PA3 46.99,8.89; PQ3/PA2 44.45,8.89; RST1 49.53,8.89; RST_2 113.03,8.89
RJ45-8 = drill 1 pad 1.88 square: 1 -4.445,6.35 | drill 1 pad 1.88: 2 -3.175,8.89; 3 -1.905,6.35; 4 -0.635,8.89; 5 0.635,6.35; 6 1.905,8.89; 7 3.175,6.35; 8 4.445,8.89 | hole 3.2: -5.715,0; 5.715,0
MAX3070E = smd 0.49 x 1.3: A -1.905,2.857; B -0.635,2.857; DI 0.635,-2.857; GND 1.905,-2.857; RO -0.635,-2.857; VCC -1.905,-2.857; Y 1.905,2.857; Z 0.635,2.857
APP45_MOUNTING_WING_HORIZ = hole 4.318: -7.366,3.937
APP45_PCB_HORIZ_RIGHT_2HIGH = drill 4.064: P$2 36.068,3.937
22-23-2041 = drill 1 long: 1 -3.81,0; 2 -1.27,0; 3 1.27,0; 4 3.81,0

### Placement (x,y rotation side)
5V-INT  H_WR-TBL_321*0002HORIZ  [691322110002]  141.86,22.73 90 top
AUX1+  -11.43,102.87 0 top
AUX1-  -11.43,110.74 0 top
AUX2+  -11.43,118.62 0 top
AUX2-  -11.43,126.49 0 top
BATT-NEG  99.31,12.7 0 top
BATT-POS  62.74,12.7 0 top
BB-8-5V  48.51,136.65 270 top
C1  59.44,81.28 0 top
C2  72.14,91.95 0 top
C3  72.14,74.17 0 top
C4  59.44,100.84 0 top
C5  50.55,3.3 180 top
C6  40.39,145.53 180 top
C7  24.64,137.16 0 top
C8  47.24,117.35 90 top
C9  42.67,118.87 180 top
C10  36.32,141.48 0 top
C11  40.39,161.04 180 top
C12  35.31,161.04 180 top
C16  24.64,21.59 0 top
C19  126.24,44.07 270 bottom
C20  144.41,84.47 270 bottom
C22  177.04,103.63 90 top  (outside the outline)
C23  47.37,18.41 90 top
C24  24.64,38.1 0 top
C25  47.37,84.45 90 top
C26  24.64,54.61 0 top
C27  42.86,85.73 180 top
C28  24.64,71.12 0 top
C29  47.37,67.95 90 top
C30  24.64,87.63 0 top
C31  42.8,69.06 180 top
C32  24.64,104.14 0 top
C33  47.37,51.44 90 top
C35  42.8,52.55 180 top
C36  24.64,120.65 0 top
C37  43.4,3.37 180 top
C38  42.77,19.68 180 top
C39  47.37,34.92 90 top
C40  42.8,36.04 180 top
C41  47.37,100.97 90 top
C42  42.86,102.08 180 top
C43  35.31,145.54 180 top
C45  79.69,138.4 270 top
C46  69.91,138.4 270 top
C47  36.32,138.94 0 top
C48  36.32,136.14 0 top
C49  41.91,141.48 180 top
C50  41.91,138.94 180 top
C51  41.91,136.14 180 top
C52  32.26,140.21 90 top
D1  68.33,113.03 0 top
D2  81.06,21.46 0 top
FINN-12V  119,83.95 0 top
LED1  37.59,3.56 0 top
LED2  16.76,150.11 180 top
LED3  16.76,165.86 180 top
LED5  147.45,17.14 180 top
LED6  37.59,19.81 0 top
LED7  37.59,36.07 0 top
LED8  37.59,52.58 0 top
LED9  37.59,69.09 0 top
LED10  37.59,85.6 0 top
LED11  37.34,118.87 0 top
LED12  37.59,102.11 0 top
M1+  -11.43,8.38 0 top
M1-  -11.43,16.26 0 top
M2+  -11.43,24.13 0 top
M2-  -11.43,32 0 top
M2-1  -11.43,157.99 0 top
M2-2  -11.43,142.24 0 top
M2-3  -11.43,165.86 0 top
M2-4  -11.43,150.11 0 top
M3+  -11.43,39.88 0 top
M3-  -11.43,47.75 0 top
M4+  -11.43,55.63 0 top
M4-  -11.43,63.5 0 top
M5+  -11.43,71.37 0 top
M5-  -11.43,79.25 0 top
M6+  -11.43,87.12 0 top
M6-  -11.43,95 0 top
POE-12V  100.84,43.94 0 top
Q1  34.04,127 270 top
Q2  98.04,123.7 270 bottom
Q6  34.04,11.43 270 top
Q7  34.04,27.94 270 top
Q9  34.04,44.45 270 top
Q11  34.04,60.96 270 top
Q12  98.04,84.07 270 bottom
Q14  34.04,77.47 270 top
Q16  34.04,93.98 270 top
Q20  34.04,110.49 270 top
R1  131.06,47.5 90 bottom
R2  130.81,31.24 90 bottom
R3  82.6,131.32 270 top
R4  86.36,135 90 top
R5  32,118.87 0 top
R6  131.06,52.83 270 bottom
R7  130.81,36.58 270 bottom
R8  20.7,166.24 270 top
R9  32.26,3.56 0 top
R10  20.83,150.37 270 top
R11  103.63,124.46 180 bottom
R13  142.49,17.4 180 top
R15  102.81,84.71 180 bottom
R16  32.26,19.81 0 top
R18  32.26,36.07 0 top
R20  32.26,52.58 0 top
R22  32.26,69.09 0 top
R24  32.26,85.6 0 top
R28  32.26,102.11 0 top
REY-5V  117.86,124.21 0 top
U$1  24.64,133.35 270 top
U$2  45.47,124.71 180 top
U$3  37.85,167.13 180 top
U$4  27.43,144.27 0 top
U$5  142.49,52.32 90 top
U$6  24.64,17.78 270 top
U$7  24.64,34.29 270 top
U$8  24.64,50.8 270 top
U$9  24.64,67.31 270 top
U$10  24.64,83.82 270 top
U$11  24.64,100.33 270 top
U$12  141.99,52.32 270 bottom
U$13  24.64,116.84 270 top
U$14  45.47,8.89 180 top
U$15  45.47,25.4 180 top
U$16  45.47,91.44 180 top
U$17  45.47,74.93 180 top
U$18  45.47,58.42 180 top
U$19  45.47,41.91 180 top
U$20  45.47,107.95 180 top
U$21  37.85,151.38 180 top
U$22  [MRDT_LOGO]  117.09,12.45 0 top
U$23  142.49,36.07 90 top
U$24  141.73,36.07 270 bottom
U$25  13.21,181.61 180 bottom
U$26  -11.43,150.11 0 top
U$27  -11.43,165.86 0 top
U$28  -11.43,157.99 0 top
U$29  -11.43,142.24 0 top
U$41  13.21,142.24 180 bottom
U$42  13.21,8.38 180 bottom
X1  4.06,190.5 90 top

### Tracks (layer width: path | path; a pad name or v marks a point on that pad's centre or on a via)
5V-AUX
  pour Top (no thermals): 37.34,171.45 37.34,168.4 35.31,166.37 22.1,166.37 20.57,167.89 20.57,171.2 22.86,173.48 35.31,173.48
5V-IMEAS  (via drill 0.5)
  Top 0.406: U$3.7 v38.48,163.7 | v48.26,165.35 88.65,165.35 v116.59,137.67
  Bottom 0.305: v116.59,137.67 119.89,137.67 U$4.PD0
  Bottom 0.406: v38.48,163.7 39.75,163.7 41.4,165.35 v48.26,165.35
5V-SIG
  Bottom 0.406: R11.2 105.05,130.2 125.48,150.62 U$4.PP2
12V-AUX
  pour Top (no thermals): 37.34,155.7 37.34,152.65 35.05,150.37 22.61,150.37 20.57,152.4 20.57,155.45 22.61,157.48 35.56,157.48
12V-IMEAS  (via drill 0.5)
  Top 0.406: U$21.7 v38.48,148.08 | v46.48,164.34 88.39,164.34 v116.33,136.4
  Bottom 0.305: v116.33,136.4 121.16,136.4 U$4.PD1
  Bottom 0.406: v38.48,148.08 38.48,161.16 41.66,164.34 v46.48,164.34
12V-SIG  (via drill 0.5)
  Top 0.406: v106.55,84.71 117.47,84.71 120.14,87.38 120.14,112.01 v108.2,123.95
  Bottom 0.406: R15.2 v106.55,84.71 | v108.2,123.95 108.2,131.06 U$4.PN3
+5V  (via drill 0.5, 0.6)  (1 unrouted)
  Top 0.254: 45.47,53.09 45.47,36.2 45.47,26.16 47.37,24.26 U$15.8 | 45.47,53.09 45.47,67.95 | 45.47,85.85 45.47,69.34 C29.2 | 45.47,85.85 45.47,102.36 | 47.37,53.09 45.47,53.09 | C25.2 45.47,85.85 | C41.2 45.47,102.36 | 46.48,118.87 47.12,118.87 C8.2 | BB-8-5V.3 45.47,135.89 45.47,118.62 | 45.47,118.62 45.47,102.36 | 47.37,118.62 45.47,118.62 | U$21.8 39.75,149.73 37.85,151.64 37.85,156.72 38.99,157.86 C11.2
  Top 0.279: 45.47,67.95 45.47,69.34
  Top 0.305: U$19.8 47.37,36.2 45.47,36.2 | C29.2 | C25.2 | U$20.8 C41.2 | C23.2 47.37,20.83 | 47.37,7.37 46.74,8 45.85,8 45.47,8.38 45.47,18.54 46.74,19.81 47.24,19.81
  Top 0.406: C23.2 47.37,19.94 | U$15.8 47.37,20.83 47.37,19.94 | U$19.8 C39.2 | U$18.8 47.37,53.09 C33.2 | U$17.8 C29.2 | U$16.8 C25.2 | U$20.8 C41.2 | 47.37,7.37 U$14.8 47.37,5.08 C5.2 | U$2.8 47.37,118.88 | 47.37,118.62 47.37,118.88 | 47.37,118.88 C8.2 | 5V-INT.R 143.88,24.52 148.84,19.56 148.84,17.25 LED5.A | 47.37,19.94 47.24,19.81 | C10.1 C47.1 | C47.1 C48.1 34.8,136.02 34.8,135.64 35.81,134.62 42.67,134.62 43.31,135.26 | C52.1 34.79,138.81 C47.1 | C51.1 C50.1 C49.1 39.26,145.53 C6.2 39.75,146.29 U$21.8 | 39.81,164.59 U$3.8 39.75,162.06 C11.2
  Top 0.508: v145.16,54.23 v145.16,37.97 145.16,27.82 5V-INT.R
  Top 0.61: C51.1 43.31,135.26
  Top 0.813: BB-8-5V.3 49.53,138.18 55.12,138.18 | 55.12,138.18 v57.91,140.97 | v65.02,148.08 67.82,150.88 88.14,150.62 89.15,151.64 v89.15,161.8 | 5V-INT.R 127.88,24.52 121.41,30.99 121.41,112.52 95.76,138.18 55.12,138.18
  Bottom 0.406: v145.16,37.97 U$24.VCC
  Bottom 0.508: U$12.VCC v145.16,54.23
  Bottom 0.813: U$4.+5V_2 148.59,194.31 111.51,194.31 109.47,192.02 105.92,192.02 103.38,194.56 89.15,194.56 | 89.15,194.56 87.38,196.34 U$4.+5V_1 | v57.91,140.97 v65.02,148.08 | v89.15,161.8 89.15,194.56
AUX_P2-IMEAS  (via drill 0.38)
  Top 0.406: U$2.7 46.15,122.86 46.1,122.94 v46.23,122.94
  Bottom 0.406: U$4.PD2 83.31,197.61 83.31,184.91 75.44,177.04 17.02,177.29 6.86,167.13 6.86,145.54 11.94,140.46 11.94,135.89 6.86,130.81 6.86,127.76 8.64,125.98 43.18,125.98 v46.23,122.94
AUX_P2-SIG  (via drill 0.5)
  Top 0.406: U$1.4 20.83,131.44 18.29,133.99 14.35,133.99 11.94,136.4 11.94,140.46 6.86,145.54 6.86,167.64 17.02,177.8 17.02,182.88 18.8,184.66 61.21,184.66 64.26,181.61 v64.26,174.75
  Bottom 0.406: U$4.PK7 v64.26,174.75
AUX_P-IMEAS  (via drill 0.38)
  Top 0.406: U$20.7 v46.41,105.84
  Bottom 0.406: U$4.PB4 82.04,184.91 74.93,177.8 16.76,178.05 6.1,167.39 6.1,145.29 11.18,140.21 11.18,136.4 6.1,131.32 6.1,113.28 8.64,110.74 41.5,110.74 v46.41,105.84
AUX_P-SIG  (via drill 0.5)
  Top 0.406: U$13.4 20.83,114.94 20.07,115.7 20.07,116.84 18.54,118.36 8.89,118.36 6.1,121.16 6.1,131.32 11.18,136.4 11.18,140.21 6.1,145.29 6.1,167.89 16.26,178.05 16.26,183.13 18.54,185.42 61.72,185.42 65.53,181.61 v65.53,174.75
  Bottom 0.406: v65.53,174.75 65.53,154.43 U$4.PQ1
GND  (via drill 0.5)  (1 unrouted)
  Top 0.406: U$14.5 43.37,6.29 v42.42,5.33 42.42,3.78 C37.2 41.81,3.56 LED1.C | C38.2 41.37,20.61 U$15.5 | C40.2 41.4,37.15 U$19.5 | C35.2 41.4,53.66 U$18.5 | C31.2 41.4,70.17 U$17.5 | C27.2 41.46,86.74 U$16.5 | C42.2 41.46,103.25 U$20.5 | C5.1 v51.95,1.65 v51.94,1.65 | LED11.C C9.2 | U$2.5 43.56,121.16 C9.2 | C9.2 41.27,118.75 v42.67,117.35 | C8.1 v48.77,115.95 | LED12.C 41.43,102.11 C42.2 | C42.2 41.46,101.79 v42.67,100.58 | C41.1 48.77,99.56 v49.02,99.57 | C30.1 23.24,86.92 U$10.1 v21.21,85.73 | C7.1 23.24,136.46 U$1.1 v21.21,135.25 | C36.1 23.24,119.95 U$13.1 v21.21,118.75 | C32.1 23.24,103.44 U$11.1 v21.21,102.23 | LED10.C 41.34,85.6 C27.2 | C27.2 41.46,85.28 v42.67,84.07 | C25.1 v49.02,83.06 | C28.1 23.24,70.42 U$9.1 v21.21,69.22 | LED9.C 41.37,69.09 C31.2 | C31.2 41.4,68.84 v42.67,67.56 | C29.1 v49.02,66.55 | C26.1 23.24,53.91 U$8.1 v21.21,52.71 | LED8.C 41.37,52.58 C35.2 | C35.2 41.4,52.33 v42.67,51.05 | C33.1 v49.02,50.04 | C24.1 23.24,37.4 U$7.1 v21.21,36.2 | LED7.C 41.37,36.07 C40.2 | C40.2 41.4,35.82 v42.67,34.54 | C39.1 v49.02,33.52 v49.02,33.53 | C16.1 23.24,20.88 U$6.1 v21.21,19.68 | LED6.C 41.24,19.81 C38.2 | C38.2 41.37,19.59 v42.67,18.29 | C23.1 v49.02,17.02 | 5V-INT.L 141.86,18.16 R13.2 | U$3.5 v35.94,163.7 35.94,163.07 C12.2 | U$21.5 v35.94,147.96 35.94,147.58 C43.2 | C47.2 C10.2 40.39,141.48 | C48.2 C51.2 C50.2 C49.2 40.39,141.48 | C52.2 32.13,141.61 v30.73,143 | 40.39,141.48 40.39,141.99 v39.12,143.26 | C11.1 v43.18,161.04 | C6.1 43.67,145.53 v43.69,145.54 | R4.1 88.11,133.58 v88.14,133.6 | LED3.C v13.46,165.86 | LED2.C v13.46,150.11
  Bottom 0.406: v51.94,1.65 51.94,1.14 51.82,1.02 | v42.67,117.35 43.18,117.35 43.43,117.09 | v48.77,115.95 49.4,115.95 49.53,116.08 | v42.67,100.58 43.18,100.58 43.43,100.33 | v49.02,99.57 49.53,99.57 | 19.81,102.62 20.19,102.23 v21.21,102.23 | v42.67,84.07 43.43,84.07 43.94,83.57 | v49.02,83.06 49.02,83.31 49.28,83.57 | v21.21,85.73 20.96,85.73 20.57,86.11 | v21.21,135.25 20.7,135.25 20.57,135.38 | v21.21,118.75 20.19,118.75 20.07,118.62 | v21.21,69.22 20.7,69.22 20.57,69.09 | v42.67,67.56 42.93,67.56 43.43,67.06 | v49.02,66.55 49.28,66.8 | v42.67,51.05 43.18,51.05 43.69,50.55 | v49.02,50.04 49.02,50.8 | v21.21,52.71 20.96,52.71 20.32,53.34 | v21.21,36.2 20.45,36.2 20.32,36.32 | v42.67,34.54 42.93,34.54 43.43,34.04 | v49.02,33.53 49.02,34.04 49.28,34.29 | v21.21,19.68 21.21,19.94 20.83,20.32 | v42.67,18.29 42.93,18.29 43.43,17.78 | v49.02,17.02 49.02,17.78 49.28,18.03 | 138.3,58.93 137.92,58.93 | v35.94,163.7 36.07,163.58 36.07,163.07 | v35.94,147.96 35.81,147.83 35.81,147.32 | v30.73,143 30.48,143 29.97,142.49 | v39.12,143.26 41.91,143 42.16,143.26 | v43.18,161.04 47.24,164.59 47.5,164.85 | v43.69,145.54 48.01,148.59 | v88.14,133.6 89.41,133.6 | v13.46,165.86 13.21,165.86 12.45,166.62 | v13.46,150.11 12.7,150.11
  pour Bottom (rank 2): -0.51,-2.54 158.24,-2.54 158.24,205.74 -0.51,205.74
  pour Bottom (no thermals): 73.15,117.09 83.31,117.09 83.31,108.71 73.15,108.71
  pour Bottom (no thermals): 59.94,103.89 79.5,103.89 79.5,65.28 59.94,65.28
  pour Bottom (no thermals): 47.24,136.91 47.24,136.14 47.75,135.64 49.28,135.64 49.78,136.14 49.78,137.16 49.28,137.67 47.75,137.67 47.24,137.16
M1-IMEAS  (via drill 0.5)
  Top 0.406: U$14.7 46.15,6.93 v46.36,6.98
  Bottom 0.406: U$4.PK3 69.34,185.17 66.55,182.37 15.24,182.63 1.14,168.53 1.14,9.27 2.79,7.62 45.72,7.62 v46.36,6.98
M1-SIG  (via drill 0.5)
  Top 0.406: U$6.4 20.96,15.88 20.32,16.51 5.84,16.51 1.14,21.21 1.14,169.04 11.68,179.58 11.68,184.66 17.02,189.99 71.88,189.99 80.77,181.1 v80.77,174.75
  Bottom 0.406: v80.77,174.75 80.77,154.43 U$4.PP5
M2-IMEAS  (via drill 0.5)
  Top 0.406: U$15.7 46.15,23.42 v46.36,23.49
  Bottom 0.406: v46.36,23.49 3.94,23.49 2.03,25.4 2.03,168.4 15.49,181.86 68.33,181.61 71.88,185.17 U$4.PK2
M2-SIG  (via drill 0.5)
  Top 0.406: U$7.4 21.91,32.26 6.86,32.26 2.03,37.08 2.03,168.91 12.45,179.32 12.45,184.4 17.27,189.23 70.36,189.23 78.23,181.1 v78.23,174.75
  Bottom 0.406: v78.23,174.75 78.23,154.43 U$4.PA7
M3-IMEAS  (via drill 0.5)
  Top 0.406: U$19.7 46.15,39.93 v46.36,40.01
  Bottom 0.406: v46.36,40.01 4.57,40.01 2.92,41.66 2.92,168.28 15.75,181.1 70.1,180.85 74.42,185.17 U$4.PK1
M3-SIG  (via drill 0.5)
  Top 0.406: U$8.4 21.15,48.01 8.13,48.01 2.92,53.21 2.92,168.78 13.21,179.07 13.21,184.15 17.53,188.47 64.77,188.47 71.88,181.36 v71.88,174.75
  Bottom 0.406: v71.88,174.75 U$4.PH0
M4-IMEAS  (via drill 0.5)
  Top 0.406: U$18.7 46.15,56.46 v46.36,56.52
  Bottom 0.406: U$4.PD4 75.69,197.61 75.69,185.17 70.61,180.09 16,180.34 3.68,168.02 3.68,144.53 6.6,141.73 8.89,139.45 8.89,137.16 3.68,131.95 3.81,57.91 6.22,55.5 45.34,55.5 v46.36,56.52
M4-SIG  (via drill 0.5)
  Top 0.406: U$9.4 20.89,64.26 5.84,64.26 3.71,66.39 3.71,74.8 3.68,131.95 8.89,137.16 8.89,139.45 3.71,144.62 3.71,168.56 13.97,178.82 13.97,183.9 17.78,187.71 63.25,187.71 69.34,181.61 v69.34,174.75
  Bottom 0.406: v69.34,174.75 U$4.PH1
M5-IMEAS  (via drill 0.5)
  Top 0.406: U$17.7 46.15,72.97 v46.36,73.03
  Bottom 0.406: U$4.PK0 76.96,185.17 71.12,179.32 16.26,179.58 4.57,167.89 4.57,144.78 9.65,139.7 9.65,136.91 4.57,131.83 4.57,74.17 7.62,71.12 44.45,71.12 v46.36,73.03
M5-SIG  (via drill 0.5)
  Top 0.406: U$10.4 19.88,79.76 6.6,79.76 4.51,81.85 4.51,89.41 4.57,131.83 9.65,136.91 9.65,139.7 4.51,144.84 4.51,168.34 14.73,178.56 14.73,183.64 18.03,186.94 62.74,186.94 68.07,181.61 v68.07,174.75
  Bottom 0.406: v68.07,174.75 68.07,154.43 U$4.PP3
M6-IMEAS  (via drill 0.5)
  Top 0.305: 46.26,87.95 U$16.7
  Top 0.406: U$16.7 46.15,89.46 v46.36,89.53
  Bottom 0.406: U$4.PB5 79.5,185.17 72.9,178.56 16.51,178.82 5.33,167.64 5.33,145.03 10.41,139.95 10.41,136.65 5.33,131.57 5.33,90.93 8.89,87.38 43.94,87.38 v46.36,89.53
M6-SIG  (via drill 0.5)
  Top 0.406: U$11.4 19.12,95.5 7.87,95.5 5.3,98.08 5.3,104.05 5.33,131.57 10.41,136.65 10.41,139.95 5.3,145.07 5.3,168.12 15.49,178.31 15.49,183.39 18.29,186.18 62.23,186.18 66.8,181.61 v66.8,174.75
  Bottom 0.406: v66.8,174.75 U$4.PK6
N$1
  Top 0.406: U$14.6 44.83,4.57 C37.1
N$2
  Top 0.406: C38.1 44.78,20.3 U$15.6
N$3  (via drill 0.5)
  Top 0.406: X1.4 v12.19,194.31 | v23.88,183.64 23.88,180.59 16.76,173.48 M2-3.P$1
  Bottom 0.406: v12.19,194.31 13.21,194.31 v23.88,183.64
N$4  (via drill 0.5)
  Top 0.406: v87.63,46.23 87.63,77.98 FINN-12V.2
  Bottom 0.406: POE-12V.2 85.34,43.94 v87.63,46.23 | FINN-12V.2 96.99,83.95 Q12.3
N$5  (via drill 0.5)
  Top 0.406: X1.3 v12.19,191.77 | v22.35,183.64 22.35,180.09 9.14,166.88 9.14,163.83 11.18,161.8 16.64,161.8 M2-1.P$1
  Bottom 0.406: v12.19,191.77 14.22,191.77 v22.35,183.64
N$6
  Top 0.406: LED5.C 144.15,17.14 R13.1
N$7  (1 unrouted)
  Top 1.27: REY-5V.P$6 REY-5V.P$7 136.65,123.95
  Top 7.62: 136.65,123.95 90.42,169.93 47.5,169.93
  pour Top (no thermals): 48.77,173.48 40.39,173.48 38.35,171.45 38.35,168.4 40.39,166.37 49.28,166.37 49.28,173.48
  pour Top (no thermals): 129.54,125.98 141.99,113.54 146.56,113.54 147.57,114.55 147.57,120.14 145.8,121.92 143.76,121.92 136.14,129.54 133.1,129.54
N$8  (via drill 0.5)
  Top 0.406: X1.2 v12.19,189.23 | v20.83,183.64 20.83,179.58 8.38,167.13 8.38,156.97 11.18,154.18 16.64,154.18 M2-4.P$1
  Bottom 0.406: v12.19,189.23 15.24,189.23 v20.83,183.64
N$9
  Top 0.406: Q1.TAB 30.32,132.72 U$1.6 26.04,132.72 25.65,133.1 25.65,134.87 26.04,135.25 U$1.8 26.04,136.46 C7.2
  pour Top (rank 3, no thermals): 30.23,133.1 41.4,133.1 45.21,129.29 45.21,124.71 41.15,120.65 30.23,120.65
N$10
  Top 0.406: R5.1 25.76,123.46 Q1.2
  pour Top (no thermals): 28.45,125.48 28.45,123.19 27.43,122.17 21.08,122.17 18.29,119.38 14.48,119.38 12.19,121.67 12.19,123.95 14.99,126.75 27.18,126.75
N$11  (via drill 0.5)
  Top 0.406: X1.1 v12.19,186.69 | v19.3,183.64 19.3,179.07 7.62,167.39 7.62,150.88 12.45,146.05 16.64,146.05 M2-2.P$1
  Bottom 0.406: v12.19,186.69 16.26,186.69 v19.3,183.64
N$12
  Top 0.406: U$21.6 37.21,146.05 C43.1
N$14
  Top 0.406: U$1.5 27.24,129.85 26.92,129.54 Q1.1
N$15
  Top 0.406: R5.2 LED11.A
N$16
  Top 0.406: U$2.6 44.78,119.33 C9.1
N$17
  Top 0.406: C27.1 44.78,86.5 U$16.6
N$22
  Top 0.406: C31.1 44.78,69.64 U$17.6
N$23
  Top 0.406: C35.1 44.78,53.13 U$18.6
N$24
  Top 0.406: C40.1 44.78,36.62 U$19.6
N$25
  Top 0.406: C42.1 44.78,102.85 U$20.6
N$28
  Top 0.406: C24.2 26.04,37.4 U$7.8 26.04,36.2 25.4,35.56 25.4,34.29 26.04,33.66 U$7.6 30.32,33.66 Q7.TAB
  pour Top (rank 2, no thermals): 30.23,34.04 41.4,34.04 44.89,30.23 44.89,25.65 41.15,21.59 30.23,21.59
N$29
  Top 0.406: Q7.2 25.76,24.91 R16.1
  pour Top (no thermals): 10.92,25.15 10.92,28.45 13.72,31.24 18.8,31.24 21.34,28.7 26.92,28.7 28.45,27.18 28.45,25.15 27.43,24.13 11.94,24.13
N$30
  Top 0.406: Q7.1 26.92,30.48 | 26.92,30.48 27.05,30.48 | U$7.5 27.24,30.79 26.92,30.48
N$31
  Top 0.406: R16.2 LED6.A
N$33
  Top 0.61: C45.+ C46.+ 64.8,141.19 62.99,143
  Top 7.62: 126.24,91.19 126.24,114.55 97.79,143 62.99,143 51.82,153.92 46.48,153.92 | 126.24,91.19 126.62,91.57 137.03,91.57 | 126.24,91.19 126.24,60.71
  Bottom 0.406: FINN-12V.8 144.41,91.57 C20.1 | POE-12V.8 C19.1
  pour Top (no thermals): 47.24,157.48 40.13,157.48 38.35,155.7 38.35,152.65 40.64,150.37 47.5,150.37 47.5,157.23
  pour Top (no thermals): 122.68,60.71 122.68,49.78 124.21,48.26 128.27,48.26 129.79,49.78 129.79,60.71
  pour Top (no thermals): 136.65,95.12 145.41,95.12 147.57,92.96 147.57,90.04 145.54,88.01 135.76,88.01 135.13,88.65 135.13,93.6
N$34
  Top 0.406: LED3.A 19.68,165.86 R8.2
N$38
  Top 0.406: U$3.6 37.21,161.54 C12.1
N$39
  Top 0.406: R9.2 LED1.A
N$40
  Top 0.406: C16.2 26.04,20.88 U$6.8 26.04,19.68 25.4,19.05 25.4,17.78 26.04,17.14 U$6.6 30.32,17.14 Q6.TAB
  pour Top (rank 3, no thermals): 30.23,17.78 41.4,17.78 45.21,13.97 45.21,9.4 41.15,5.33 30.23,5.33
N$41
  Top 0.406: Q6.2 25.76,7.77 30.23,3.3 30.6,3.3 R9.1
  pour Top (no thermals): 10.67,9.14 10.67,12.19 13.97,15.49 18.8,15.49 22.86,11.43 26.92,11.43 28.45,9.91 28.45,8.38 27.69,7.62 12.19,7.62
N$42
  Top 0.406: U$6.5 27.24,14.54 26.67,13.97 Q6.1
N$43
  Bottom 0.406: REY-5V.P$1 96.99,123.57 Q2.3
N$44
  Top 0.406: C26.2 26.04,53.91 U$8.8 26.04,52.71 25.4,52.07 25.4,50.8 26.04,50.16 U$8.6 30.32,50.16 Q9.TAB
  pour Top (rank 3, no thermals): 30.23,50.55 41.4,50.55 45.21,46.74 45.21,42.16 41.15,38.1 30.23,38.1
N$45
  Top 0.406: Q9.2 25.76,41.16 R18.1
  pour Top (no thermals): 10.67,40.89 10.67,44.7 12.95,46.99 19.3,46.99 21.84,44.45 26.92,44.45 28.45,42.93 28.45,40.89 27.18,39.62 11.94,39.62
N$46
  Top 0.406: LED2.A 19.68,150.11 R10.2
N$47
  Top 0.406: Q9.1 26.92,46.99 | 26.92,46.99 27.05,46.99 | U$8.5 27.24,47.3 26.92,46.99
N$48
  Bottom 0.406: Q2.1 102.1,124.35 R11.1
N$49
  Top 0.406: R18.2 LED7.A
N$54
  Top 0.406: C28.2 26.04,70.42 U$9.8 26.04,69.22 25.4,68.58 25.4,67.31 26.04,66.67 U$9.6 30.32,66.67 Q11.TAB
  pour Top (rank 3, no thermals): 30.23,67.06 41.4,67.06 45.21,63.25 45.21,58.67 41.15,54.61 30.23,54.61
N$55
  Top 0.406: Q11.2 25.76,57.68 R20.1
  pour Top (isolate 0.406, no thermals): 10.67,57.4 10.67,60.96 12.95,63.25 22.1,63.25 24.38,60.96 26.92,60.96 28.45,59.44 28.45,57.4 27.18,56.39 11.94,56.39
N$56
  Top 0.406: U$9.5 27.24,63.81 26.92,63.5 Q11.1
N$57
  Top 0.406: R20.2 LED8.A
N$60
  Top 0.406: C30.2 26.04,86.92 U$10.8 26.04,85.73 25.4,85.09 25.4,83.82 26.04,83.19 U$10.6 30.32,83.19 Q14.TAB
  pour Top (rank 3, no thermals): 30.23,83.57 41.4,83.57 45.21,79.76 45.21,75.18 41.15,71.12 30.23,71.12
N$61
  Top 0.406: Q14.2 25.76,74.19 R22.1
  pour Top (no thermals): 10.92,74.17 10.92,76.45 12.45,78.23 26.42,78.23 28.45,75.95 28.45,73.91 26.92,72.64 22.1,72.64 21.84,72.39 12.45,72.39
N$62
  Top 0.406: U$10.5 27.24,80.58 26.67,80.01 Q14.1
N$63
  Top 0.406: R22.2 LED9.A
N$66
  Top 0.406: Q16.TAB 30.32,99.7 U$11.6 26.04,99.7 25.4,100.33 25.4,101.6 26.04,102.23 U$11.8 26.04,103.44 C32.2
  pour Top (rank 3, no thermals): 30.23,100.08 41.5,100.08 45.21,96.3 45.21,91.69 41.15,87.63 30.23,87.63
N$67
  Top 0.406: Q16.2 25.76,90.7 R24.1
  pour Top (no thermals): 11.43,90.42 11.43,92.46 13.46,94.49 26.42,94.49 28.45,92.46 28.45,90.42 27.18,89.15 20.32,89.15 19.05,87.88 13.97,87.88
N$68
  Top 0.406: U$11.5 27.24,96.83 26.92,96.52 Q16.1
N$69
  Top 0.406: R24.2 LED10.A
N$78
  Top 0.406: Q20.TAB 30.32,116.2 U$13.6 26.04,116.2 25.4,116.84 25.4,118.11 26.04,118.75 U$13.8 26.04,119.95 C36.2
  pour Top (rank 3, no thermals): 30.23,116.59 41.4,116.59 45.21,112.78 45.21,108.2 41.15,104.14 30.23,104.14
N$79
  Top 0.406: Q20.2 25.76,107.2 R28.1
  pour Top (no thermals): 28.45,108.97 28.45,107.19 26.92,105.66 20.57,105.66 18.54,103.63 14.22,103.63 12.19,105.66 12.19,107.95 14.73,110.49 26.92,110.49
N$80
  Top 0.406: U$13.5 27.24,113.6 26.67,113.03 Q20.1
N$81
  Top 0.406: R28.2 LED12.A
N$98  (1 unrouted)
N$100  (1 unrouted)
N$114
  Bottom 0.406: Q12.1 101.37,84.72 R15.1
PRIMARY-VMEAS  (via drill 0.5)
  Top 0.305: v125.48,152.4 125.48,156.21 127.25,157.99 142.24,157.99 147.07,162.81 v147.07,188.72 | v147.07,192.28 145.54,193.8 137.16,193.8 135.38,195.58 U$4.PD7
  Top 0.406: R3.1 82.8,132.74 R4.2 86.36,136.65 86.61,136.91 95.25,136.91 v100.33,131.83
  Bottom 0.305: v147.07,188.72 v147.07,192.28
  Bottom 0.406: v100.33,131.83 104.9,131.83 v125.48,152.4
REC+
  Bottom 0.305: U$12.A 139.57,54.23 141.22,52.58 141.22,49.53 139.57,47.88 U$5.1 132.84,47.88 R1.1
REC+1
  Bottom 0.305: R2.1 132.59,31.62 U$23.1 139.57,31.62 140.97,33.02 140.97,36.58 139.57,37.97 U$24.A
REC-
  Bottom 0.305: R1.2 131.31,49.15 U$5.2 139.57,49.15 140.46,50.04 140.46,52.32 139.83,52.96 U$12.B
REC-1
  Bottom 0.305: R2.2 131.06,32.89 U$23.2 139.32,32.89 140.21,33.78 140.21,36.07 139.57,36.7 U$24.B
RX1  (via drill 0.5)
  Top 0.305: v146.81,150.88 146.81,156.46 149.35,158.75 149.35,191.52 146.81,194.06 146.81,197.61 U$4.PC4
  Bottom 0.305: U$24.RO 148.46,36.7 149.35,37.59 149.35,148.59 v146.81,150.88
RX2  (via drill 0.5)
  Top 0.305: v141.73,150.88 141.73,156.46 147.83,162.56 147.83,189.23 144.53,192.53 81.03,192.53 78.23,195.33 78.23,199.39 78.99,200.15 81.03,200.15 82.04,199.14 U$4.PP0
  Bottom 0.305: U$12.RO 146.69,52.96 147.83,54.1 147.83,145.03 v141.73,150.88
TRANS+
  Bottom 0.305: U$12.Y U$5.3 132.08,50.42 R6.2
TRANS+1
  Bottom 0.305: U$24.Y U$23.3 131.82,34.16 R7.2
TRANS-
  Bottom 0.305: U$12.Z 135.51,51.69 134.62,52.58 134.62,53.21 U$5.6 R6.1
TRANS-1
  Bottom 0.305: R7.1 U$23.6 134.62,36.96 134.62,36.32 135.51,35.43 U$24.Z
TX1  (via drill 0.5)
  Top 0.305: U$4.PC5 143,199.64 144.02,200.66 148.34,200.66 149.35,199.64 149.35,192.53 150.11,191.77 150.11,157.23 149.35,156.46 v149.35,150.88
  Bottom 0.305: U$24.DI 148.72,35.43 150.11,36.83 150.11,150.11 v149.35,150.88
TX2  (via drill 0.5)
  Top 0.305: v144.27,150.88 144.27,156.46 148.59,160.78 148.59,189.48 144.91,193.17 82.68,193.17 80.77,195.07 80.77,197.61 U$4.PP1
  Bottom 0.305: U$12.DI 147.45,51.69 148.59,52.83 148.59,146.81 v144.27,150.88
V_BATT
  Top 0.406: 84.48,130.66 84.58,130.56
  pour Top (rank 2, no thermals): 45.47,114.3 45.47,107.95 50.55,107.95 50.55,97.79 45.47,97.79 45.47,91.44 50.55,91.44 50.55,81.28 45.47,81.28 45.47,74.93 50.55,74.93 50.55,64.77 45.47,64.77 45.47,58.42 50.55,58.42 50.55,48.26 45.47,48.26 45.47,41.91 50.55,41.91 50.55,31.75 45.78,31.75 45.78,25.4 50.55,25.4 50.55,15.24 45.47,15.24 45.47,8.89 50.55,8.89 55.72,1.78 86.11,1.75 86.11,131.06 50.55,131.06 50.55,114.3
  pour Top (no thermals): 83.82,93.98 95.25,93.98 97.03,92.2 97.03,90.42 95.5,88.9 83.57,88.9 82.55,89.92 82.55,92.71
  pour Top (no thermals): 83.82,118.36 95.25,118.36 97.03,116.59 97.03,114.81 95.5,113.28 83.57,113.28 82.55,114.3 82.55,117.09
  pour Top (no thermals): 51.05,124.71 45.97,124.71 45.97,133.86 47.24,135.13 49.78,135.13 50.8,134.11 50.8,124.97

### Text on the board
Top: ROVE DOWN FOR WHAT
tPlace: +5V | GND | +12V | GND | A2 | REY-5V | A1 | M6 | M5 | RS-485 | M4 | M3 | M2 | + - | M1 | Missouri S&T Mars Rover / Design Team / Power Board 2016 | + - / VPACK